# EAGLE schematic cube (EAGLE 9.0.0), part 1 of 2
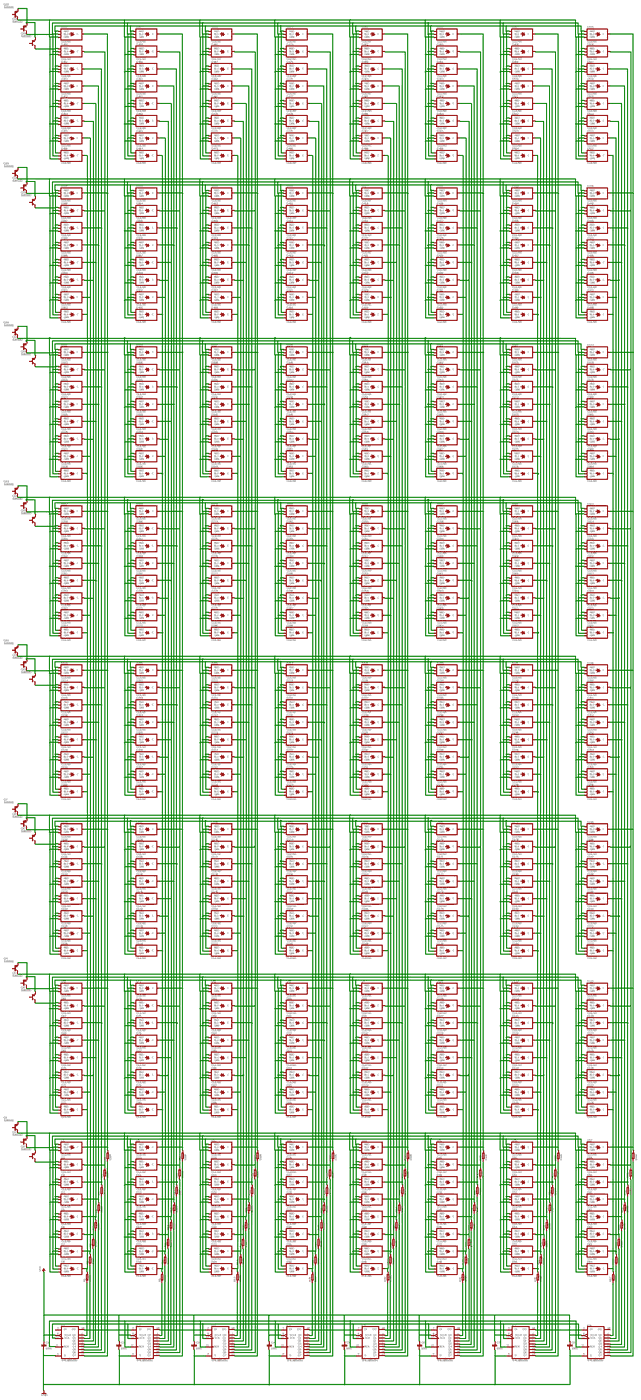
[diagram p0: schematic, sheet 1, overview]
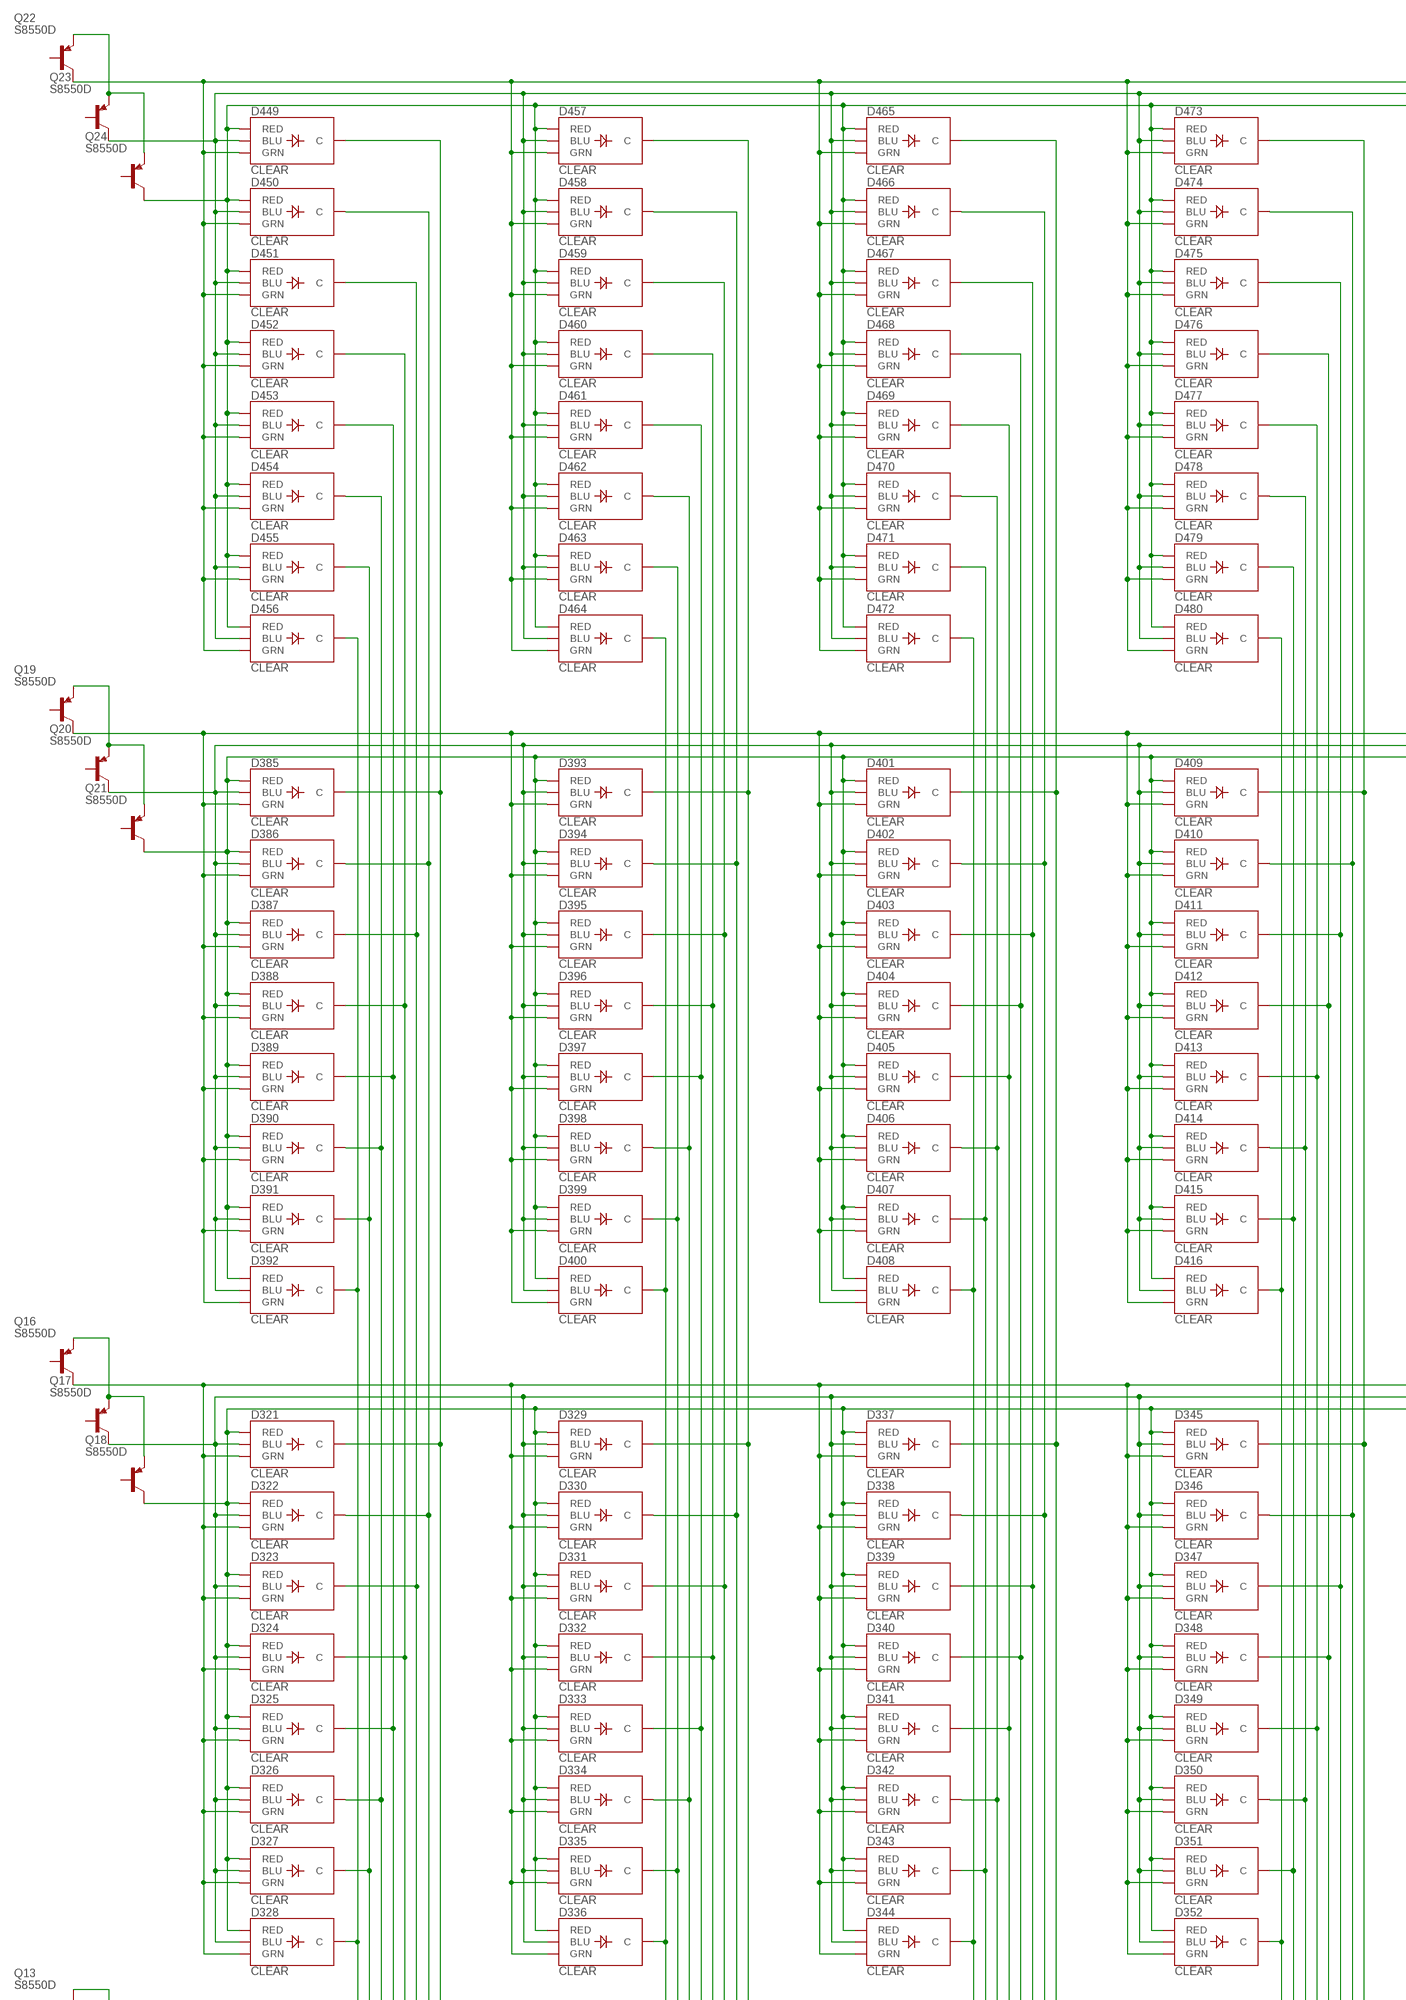
[diagram p1: schematic, sheet 1, part 1 of 8]
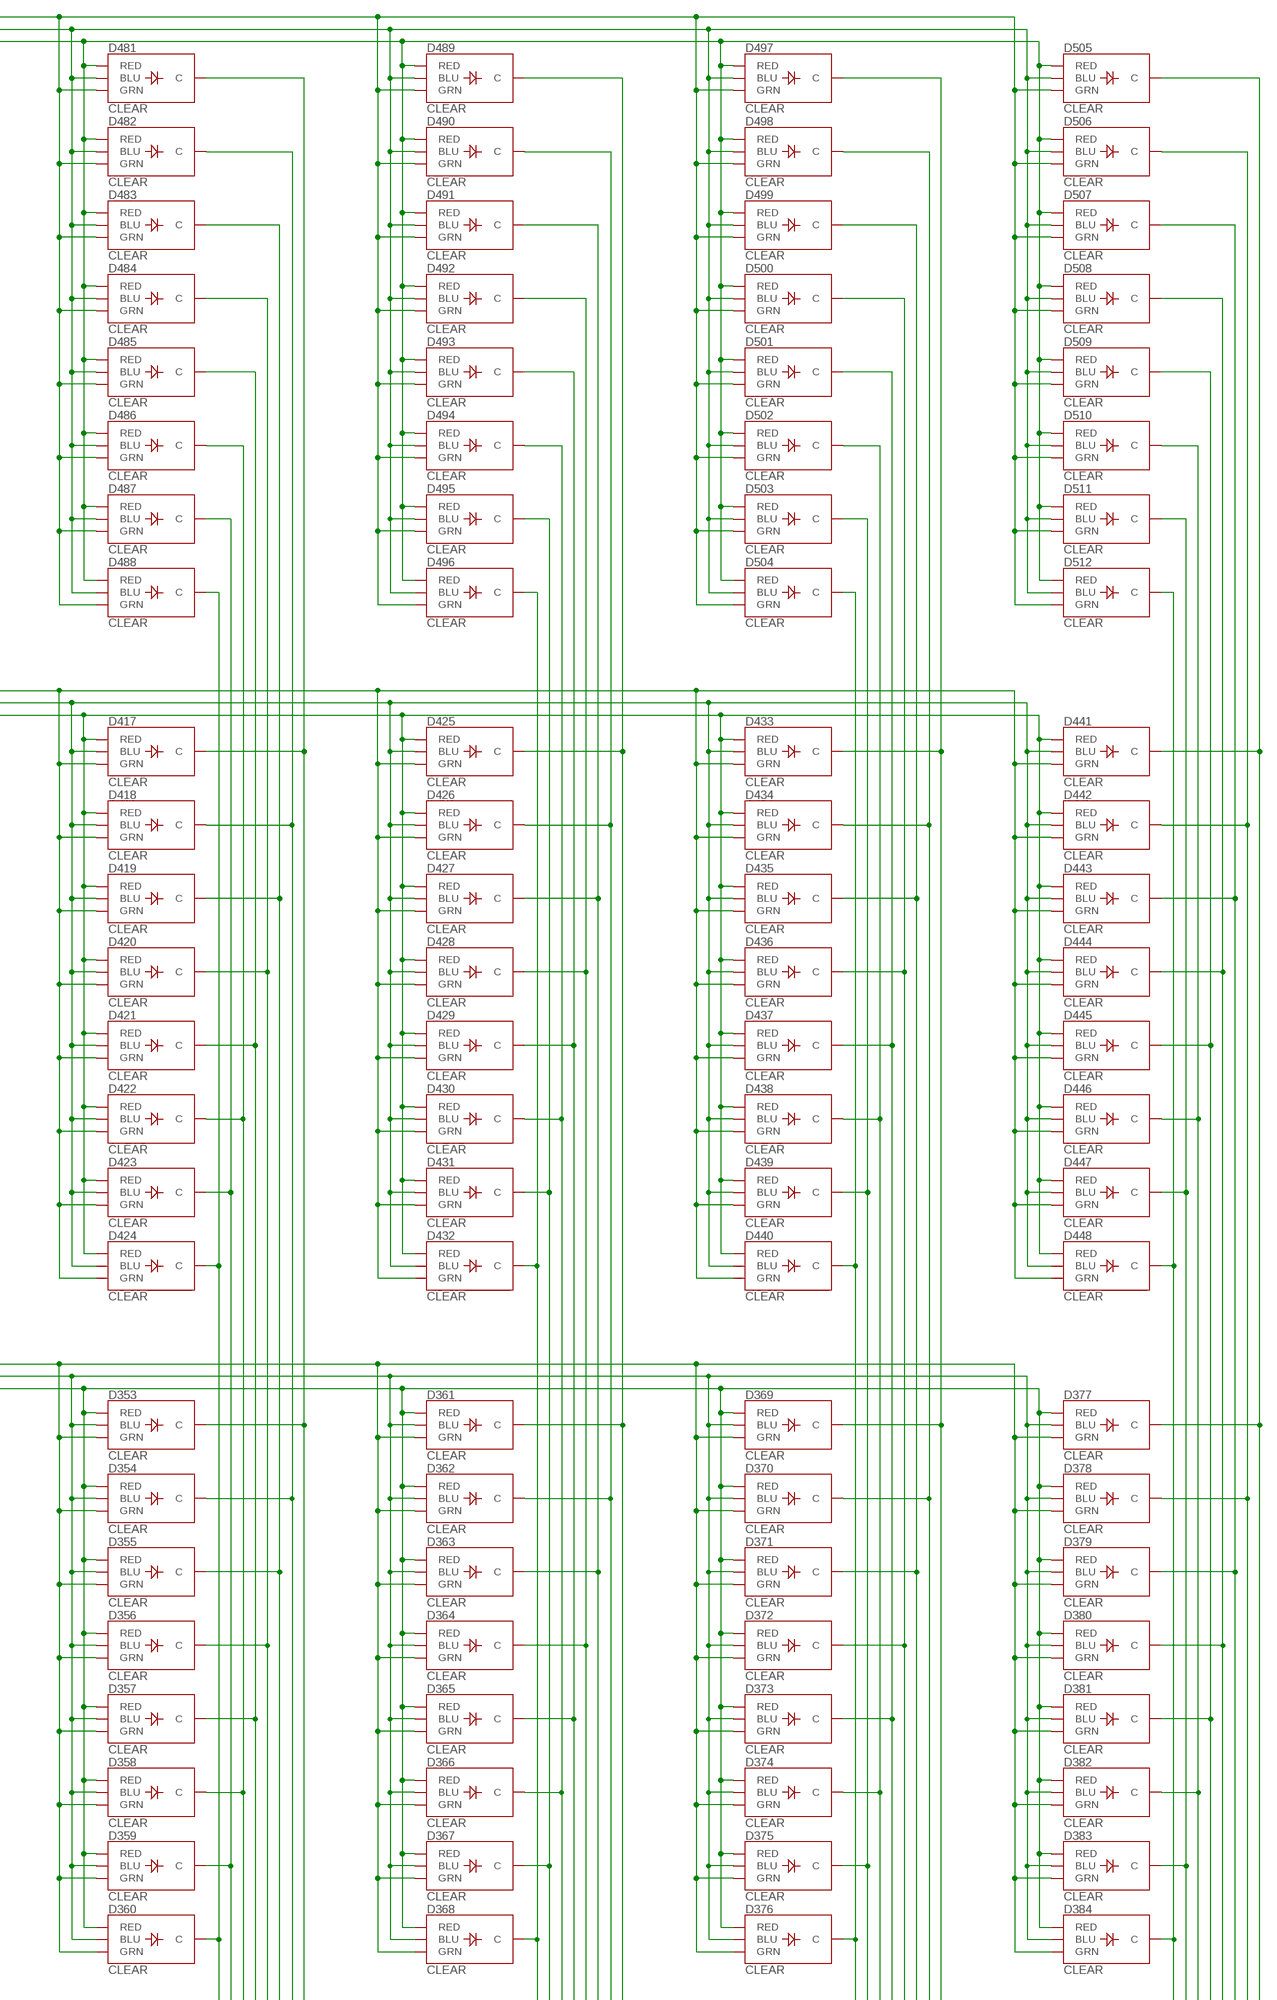
[diagram p2: schematic, sheet 1, part 2 of 8]
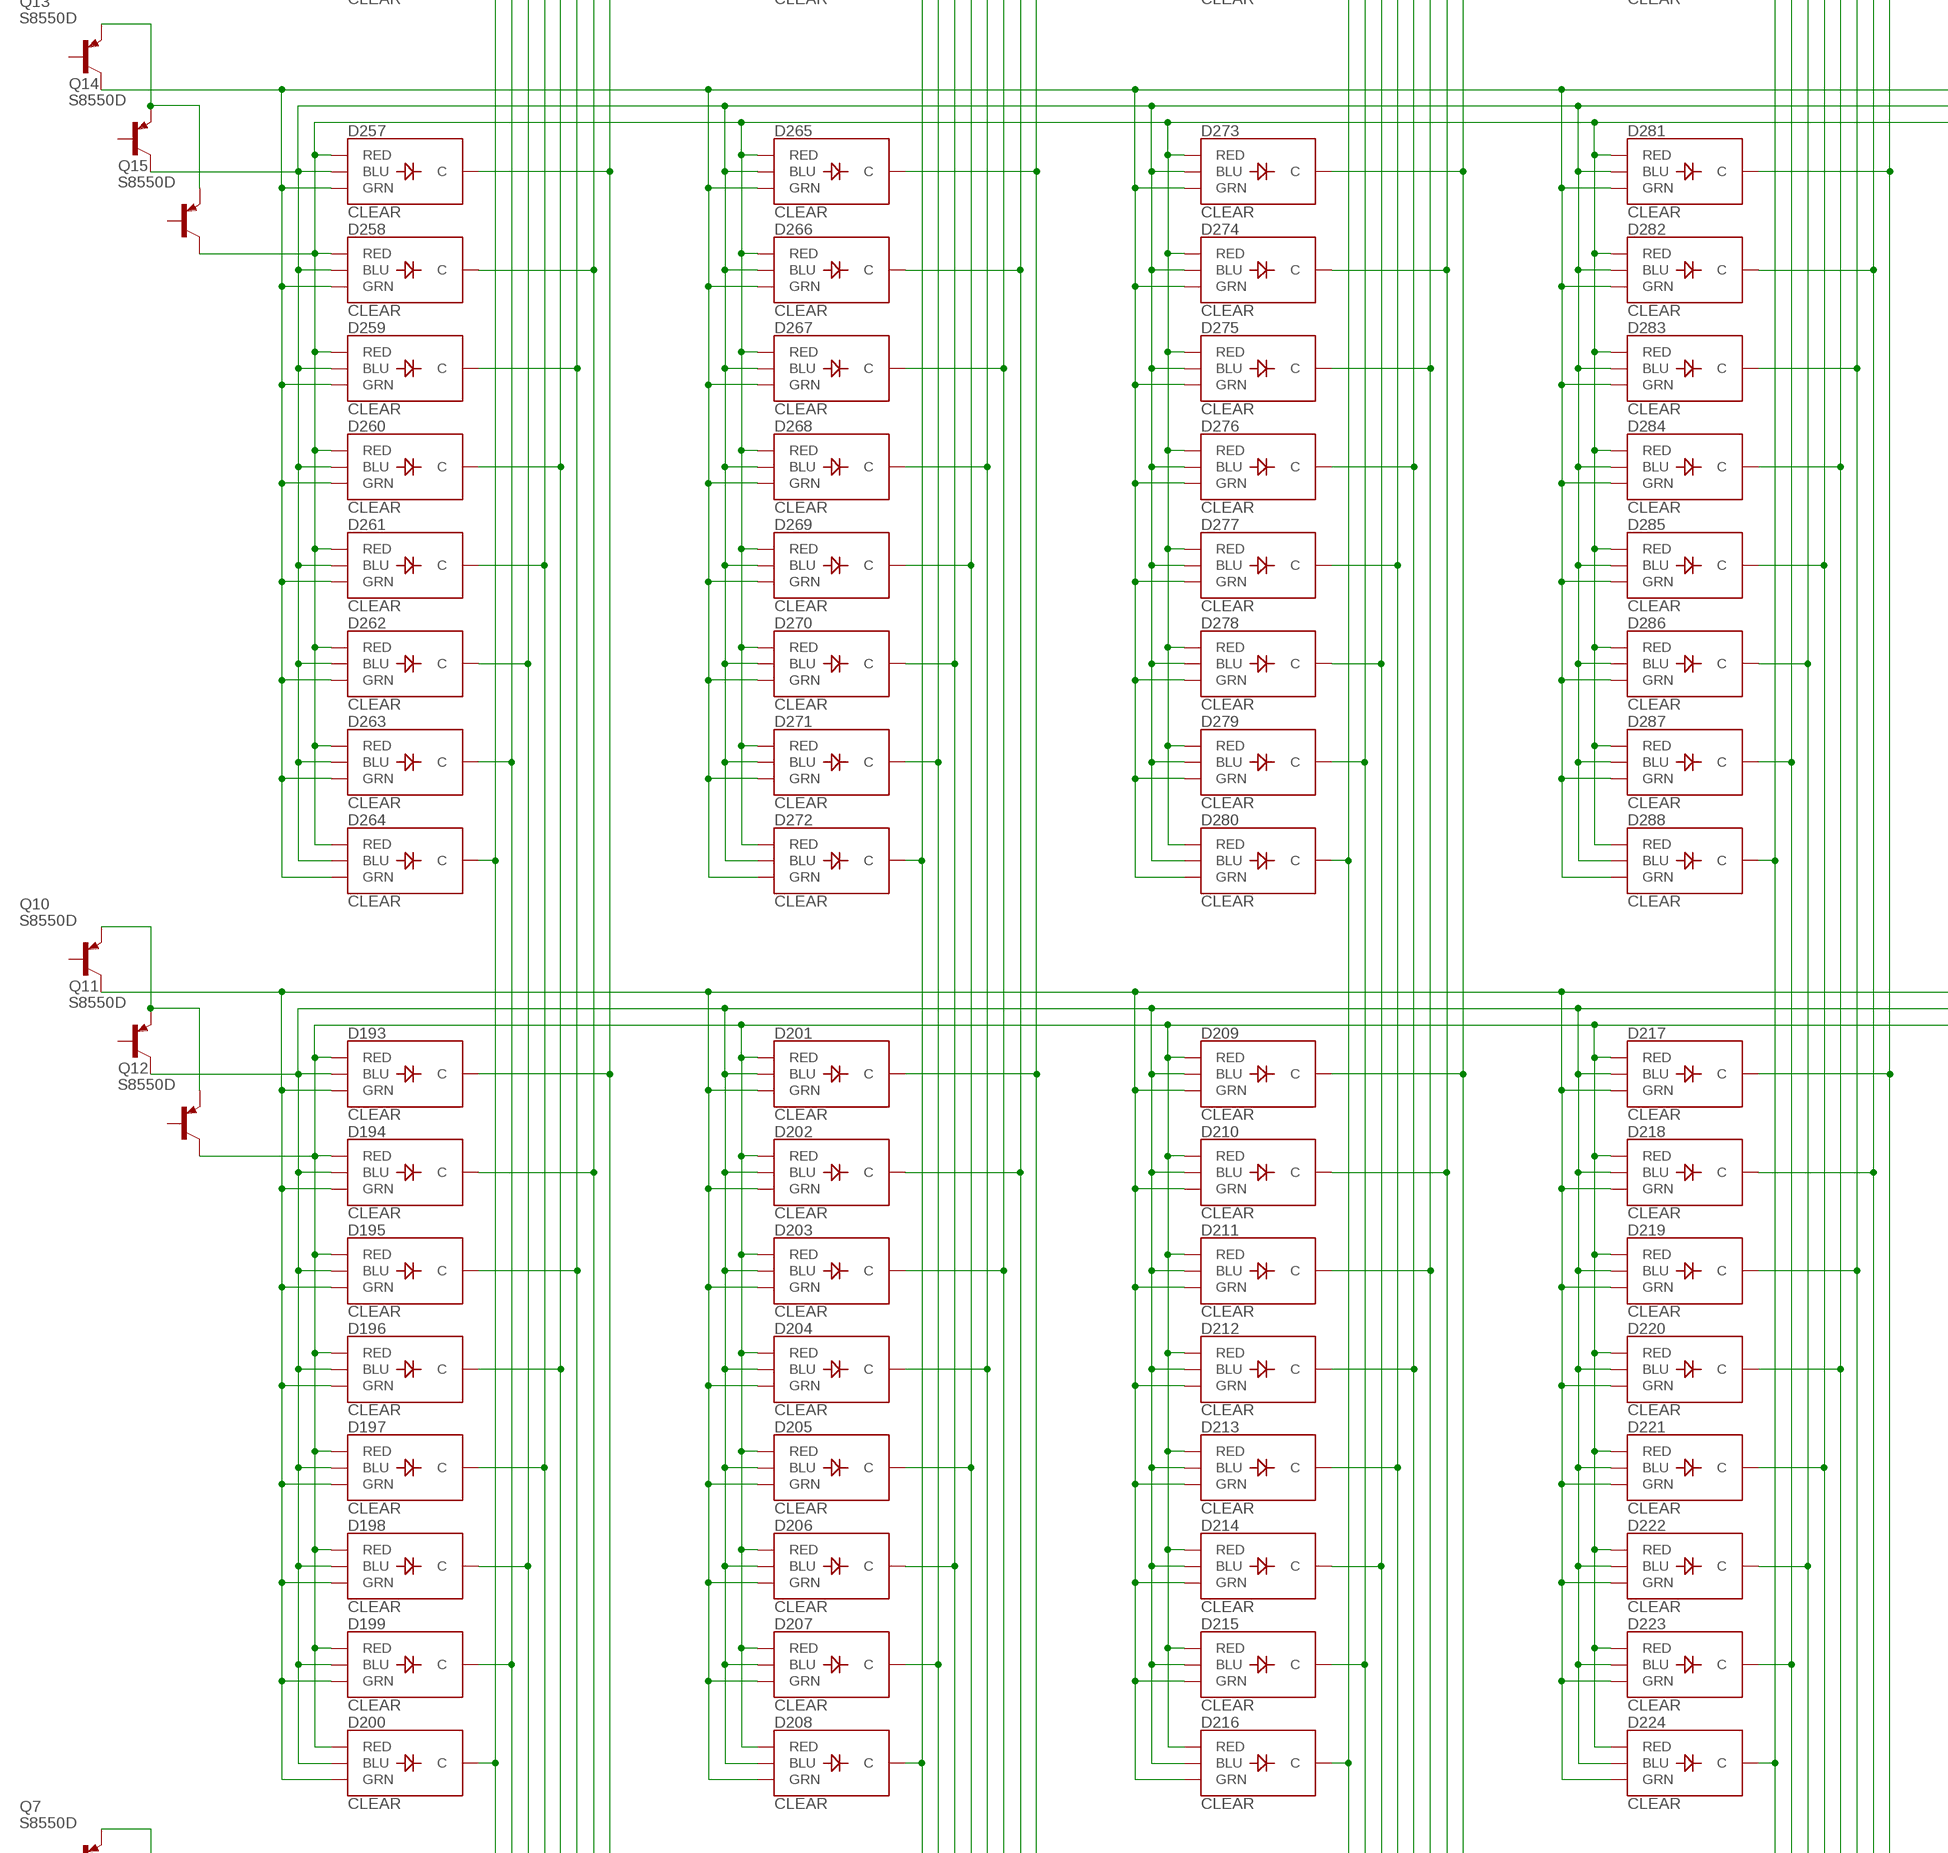
[diagram p3: schematic, sheet 1, part 3 of 8]
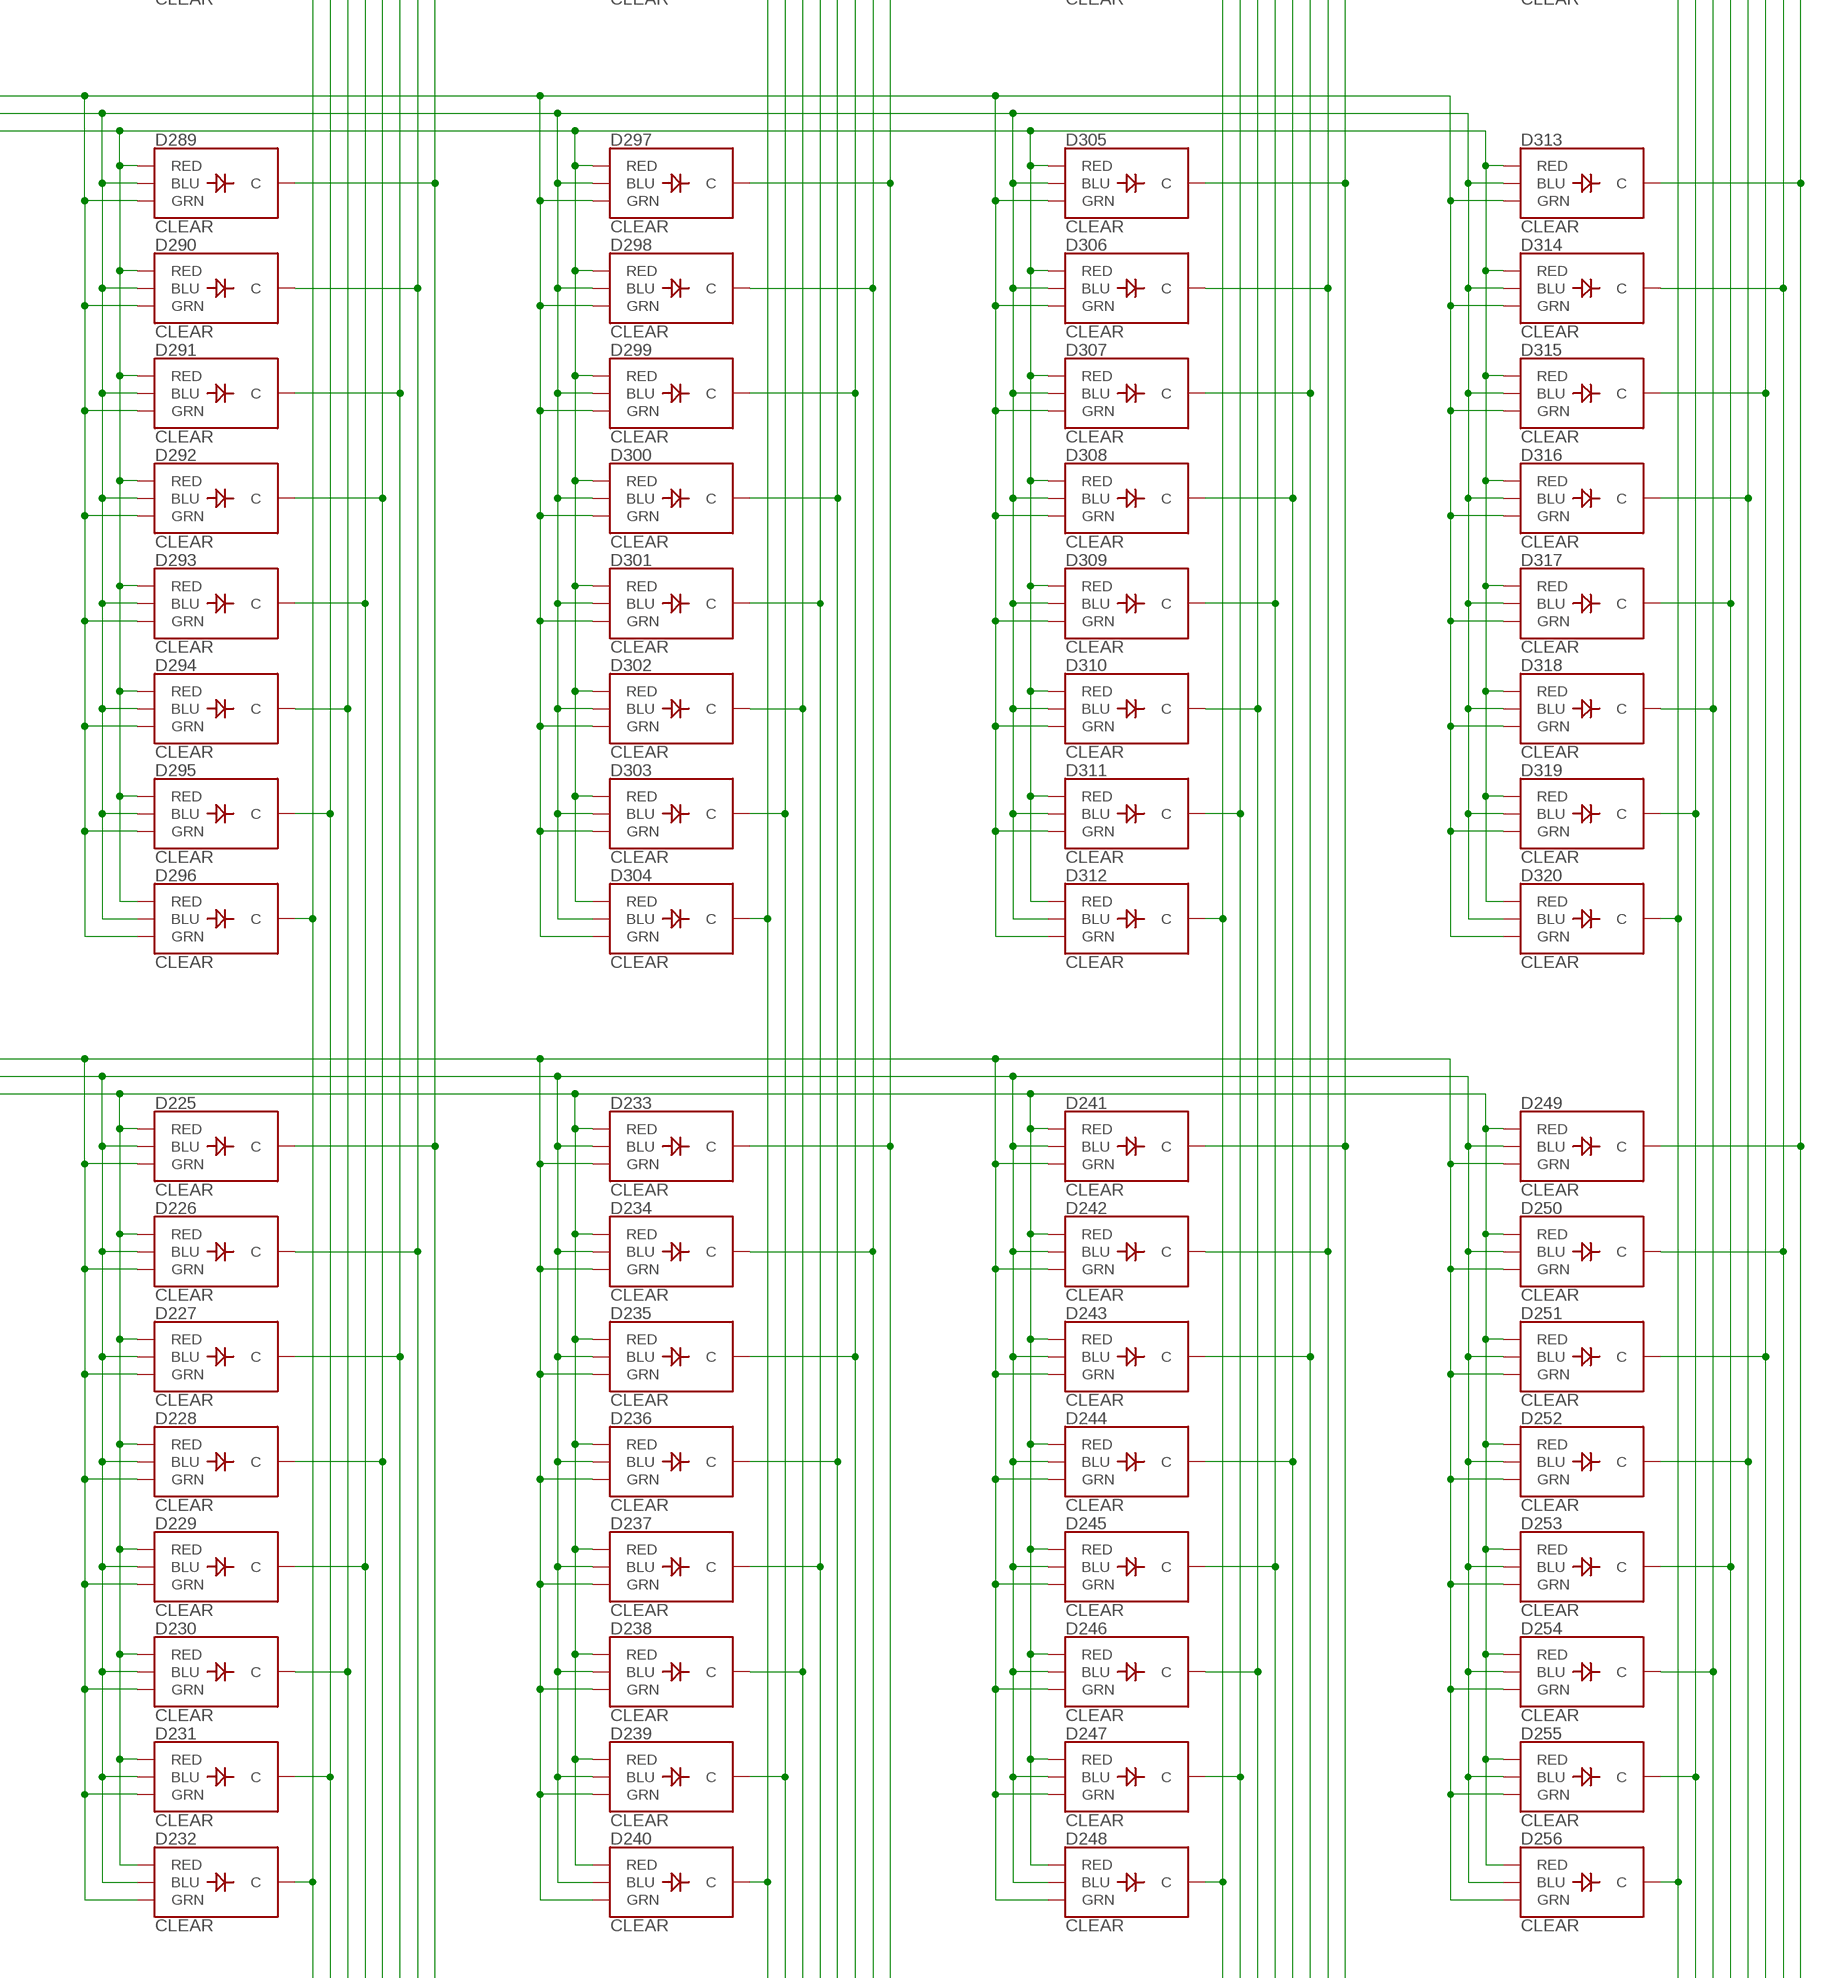
[diagram p4: schematic, sheet 1, part 4 of 8]
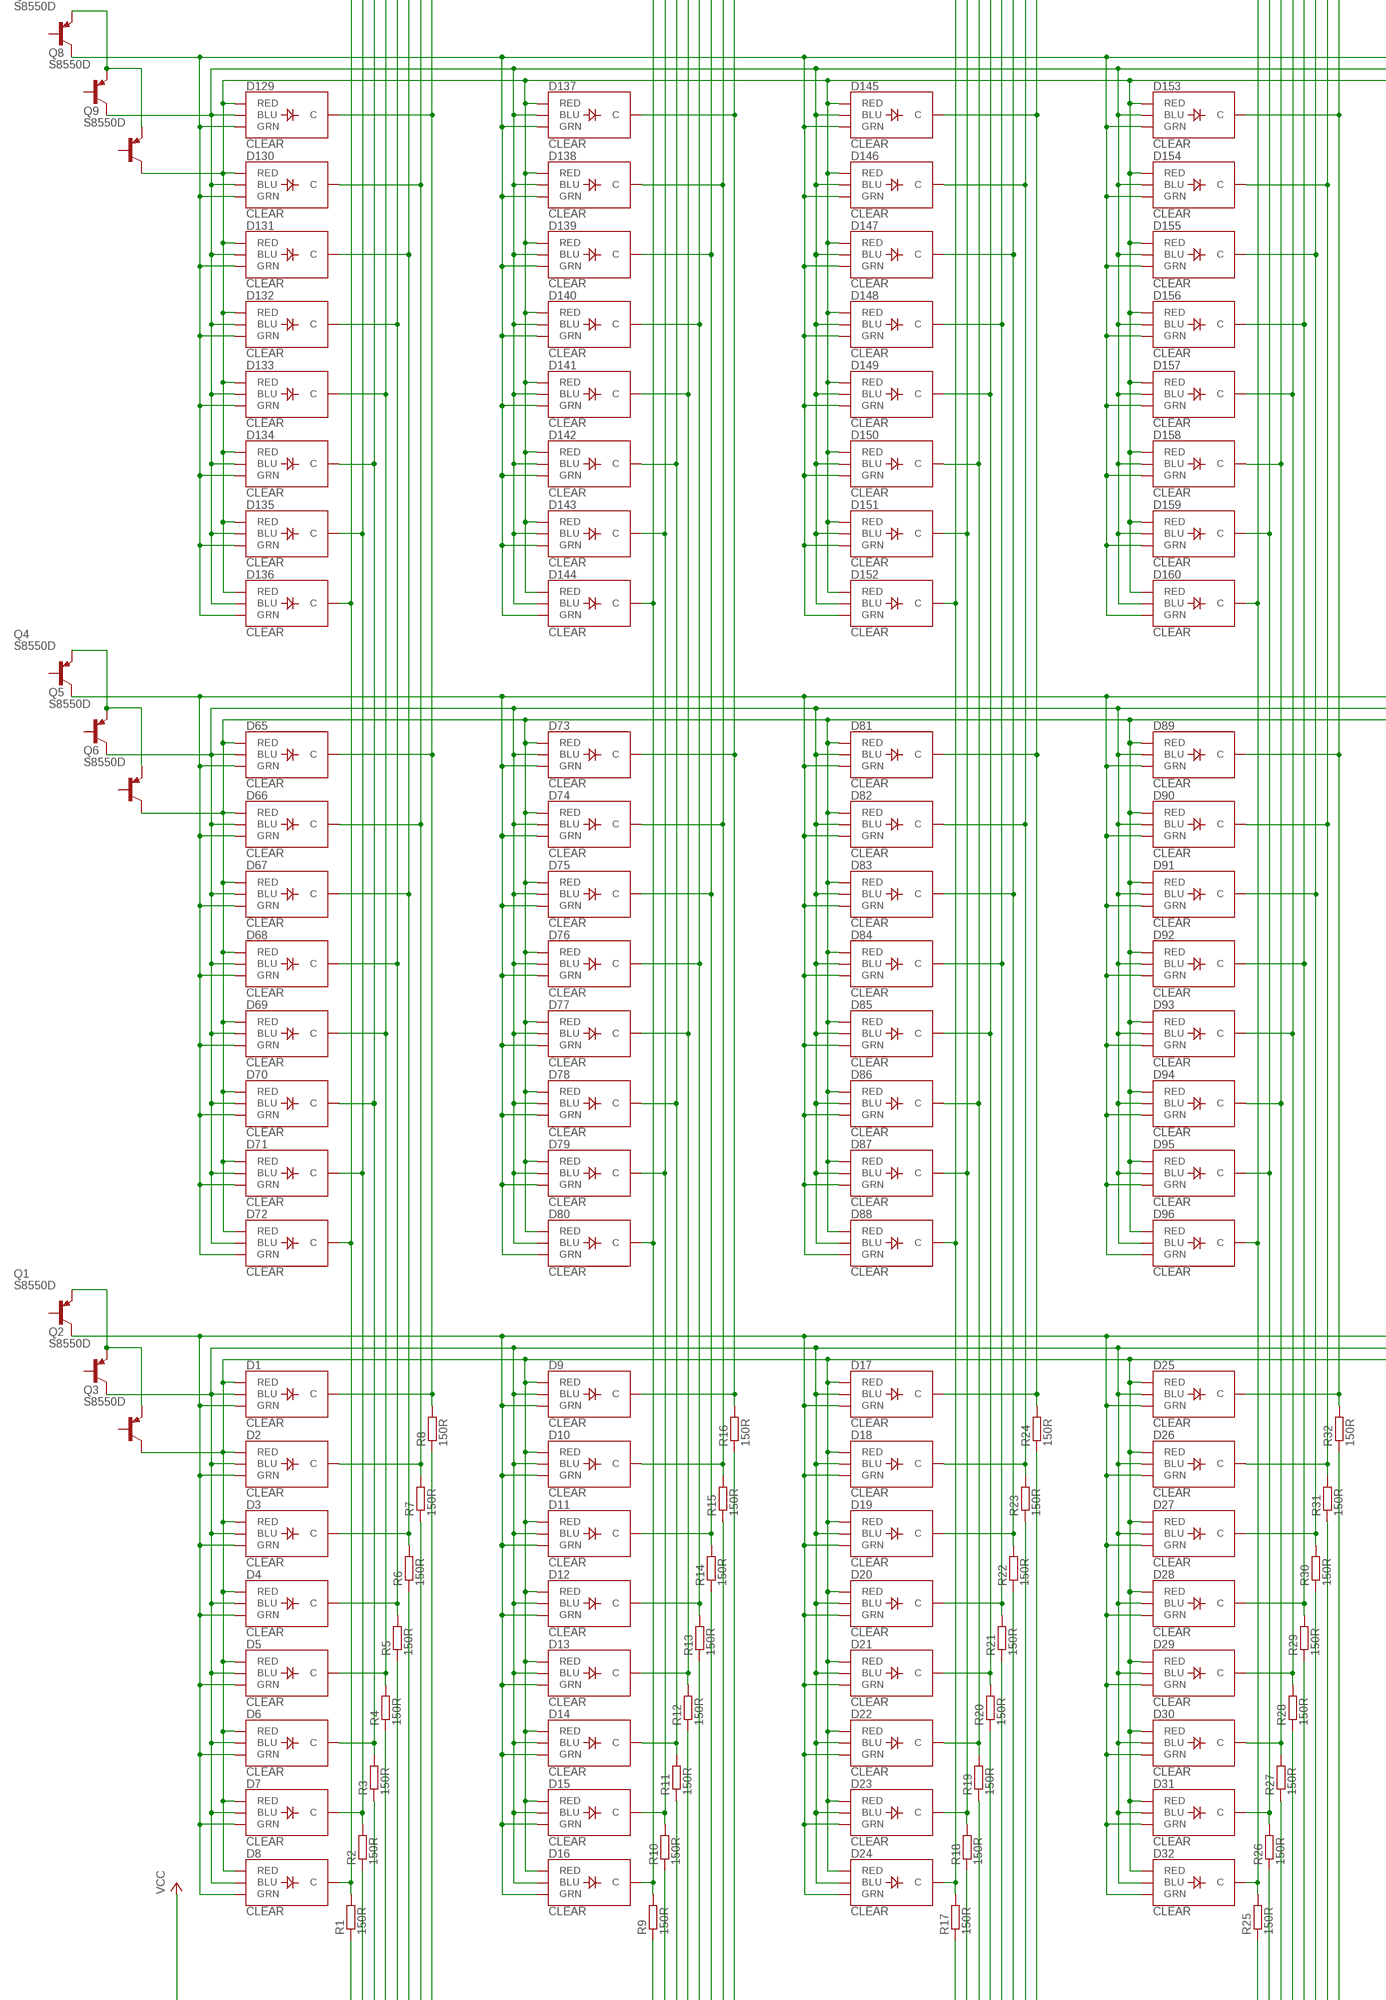
[diagram p5: schematic, sheet 1, part 5 of 8]
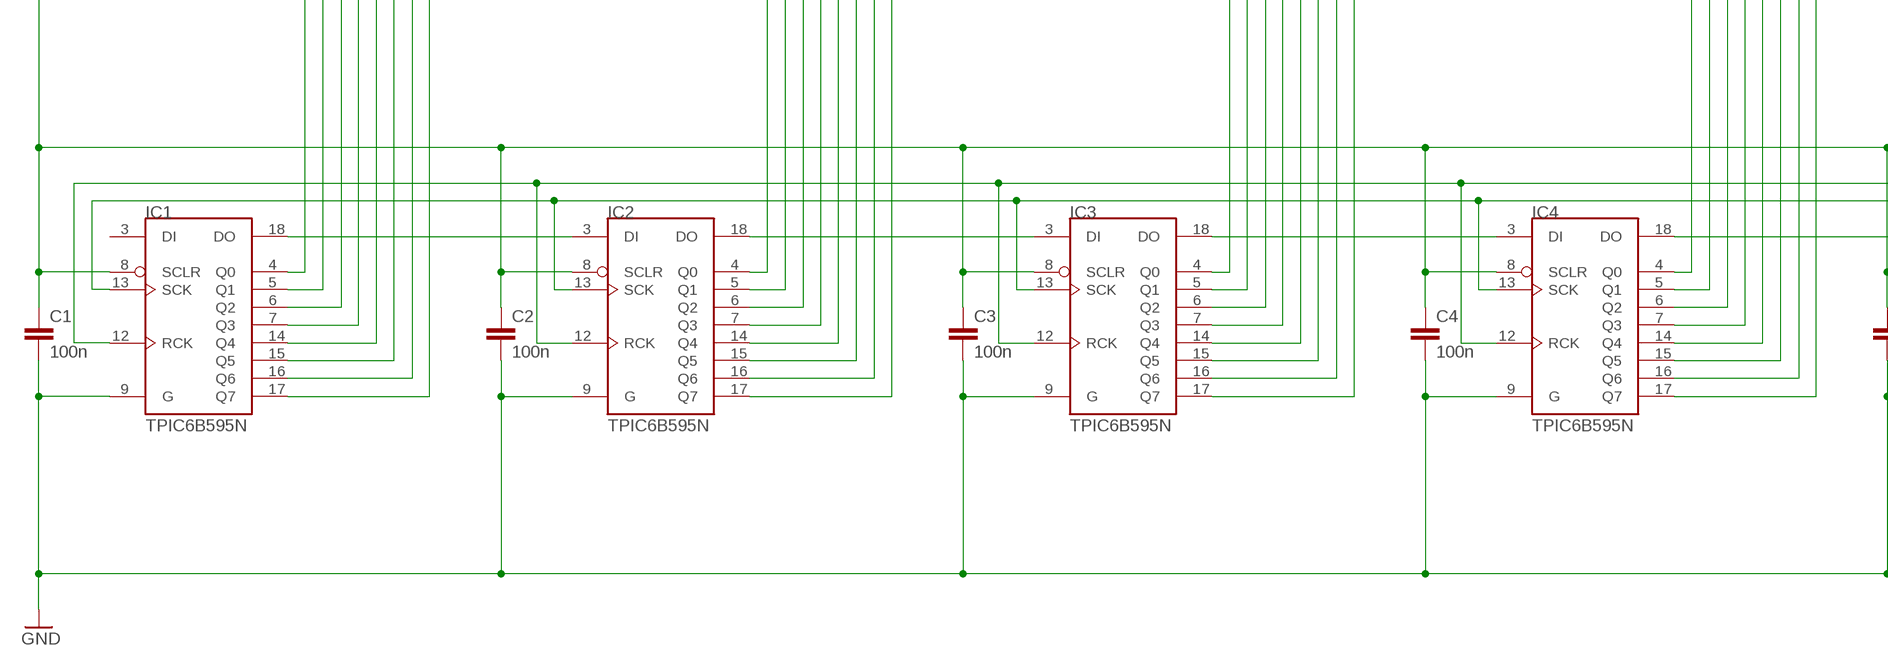
[diagram p6: schematic, sheet 1, part 6 of 8]
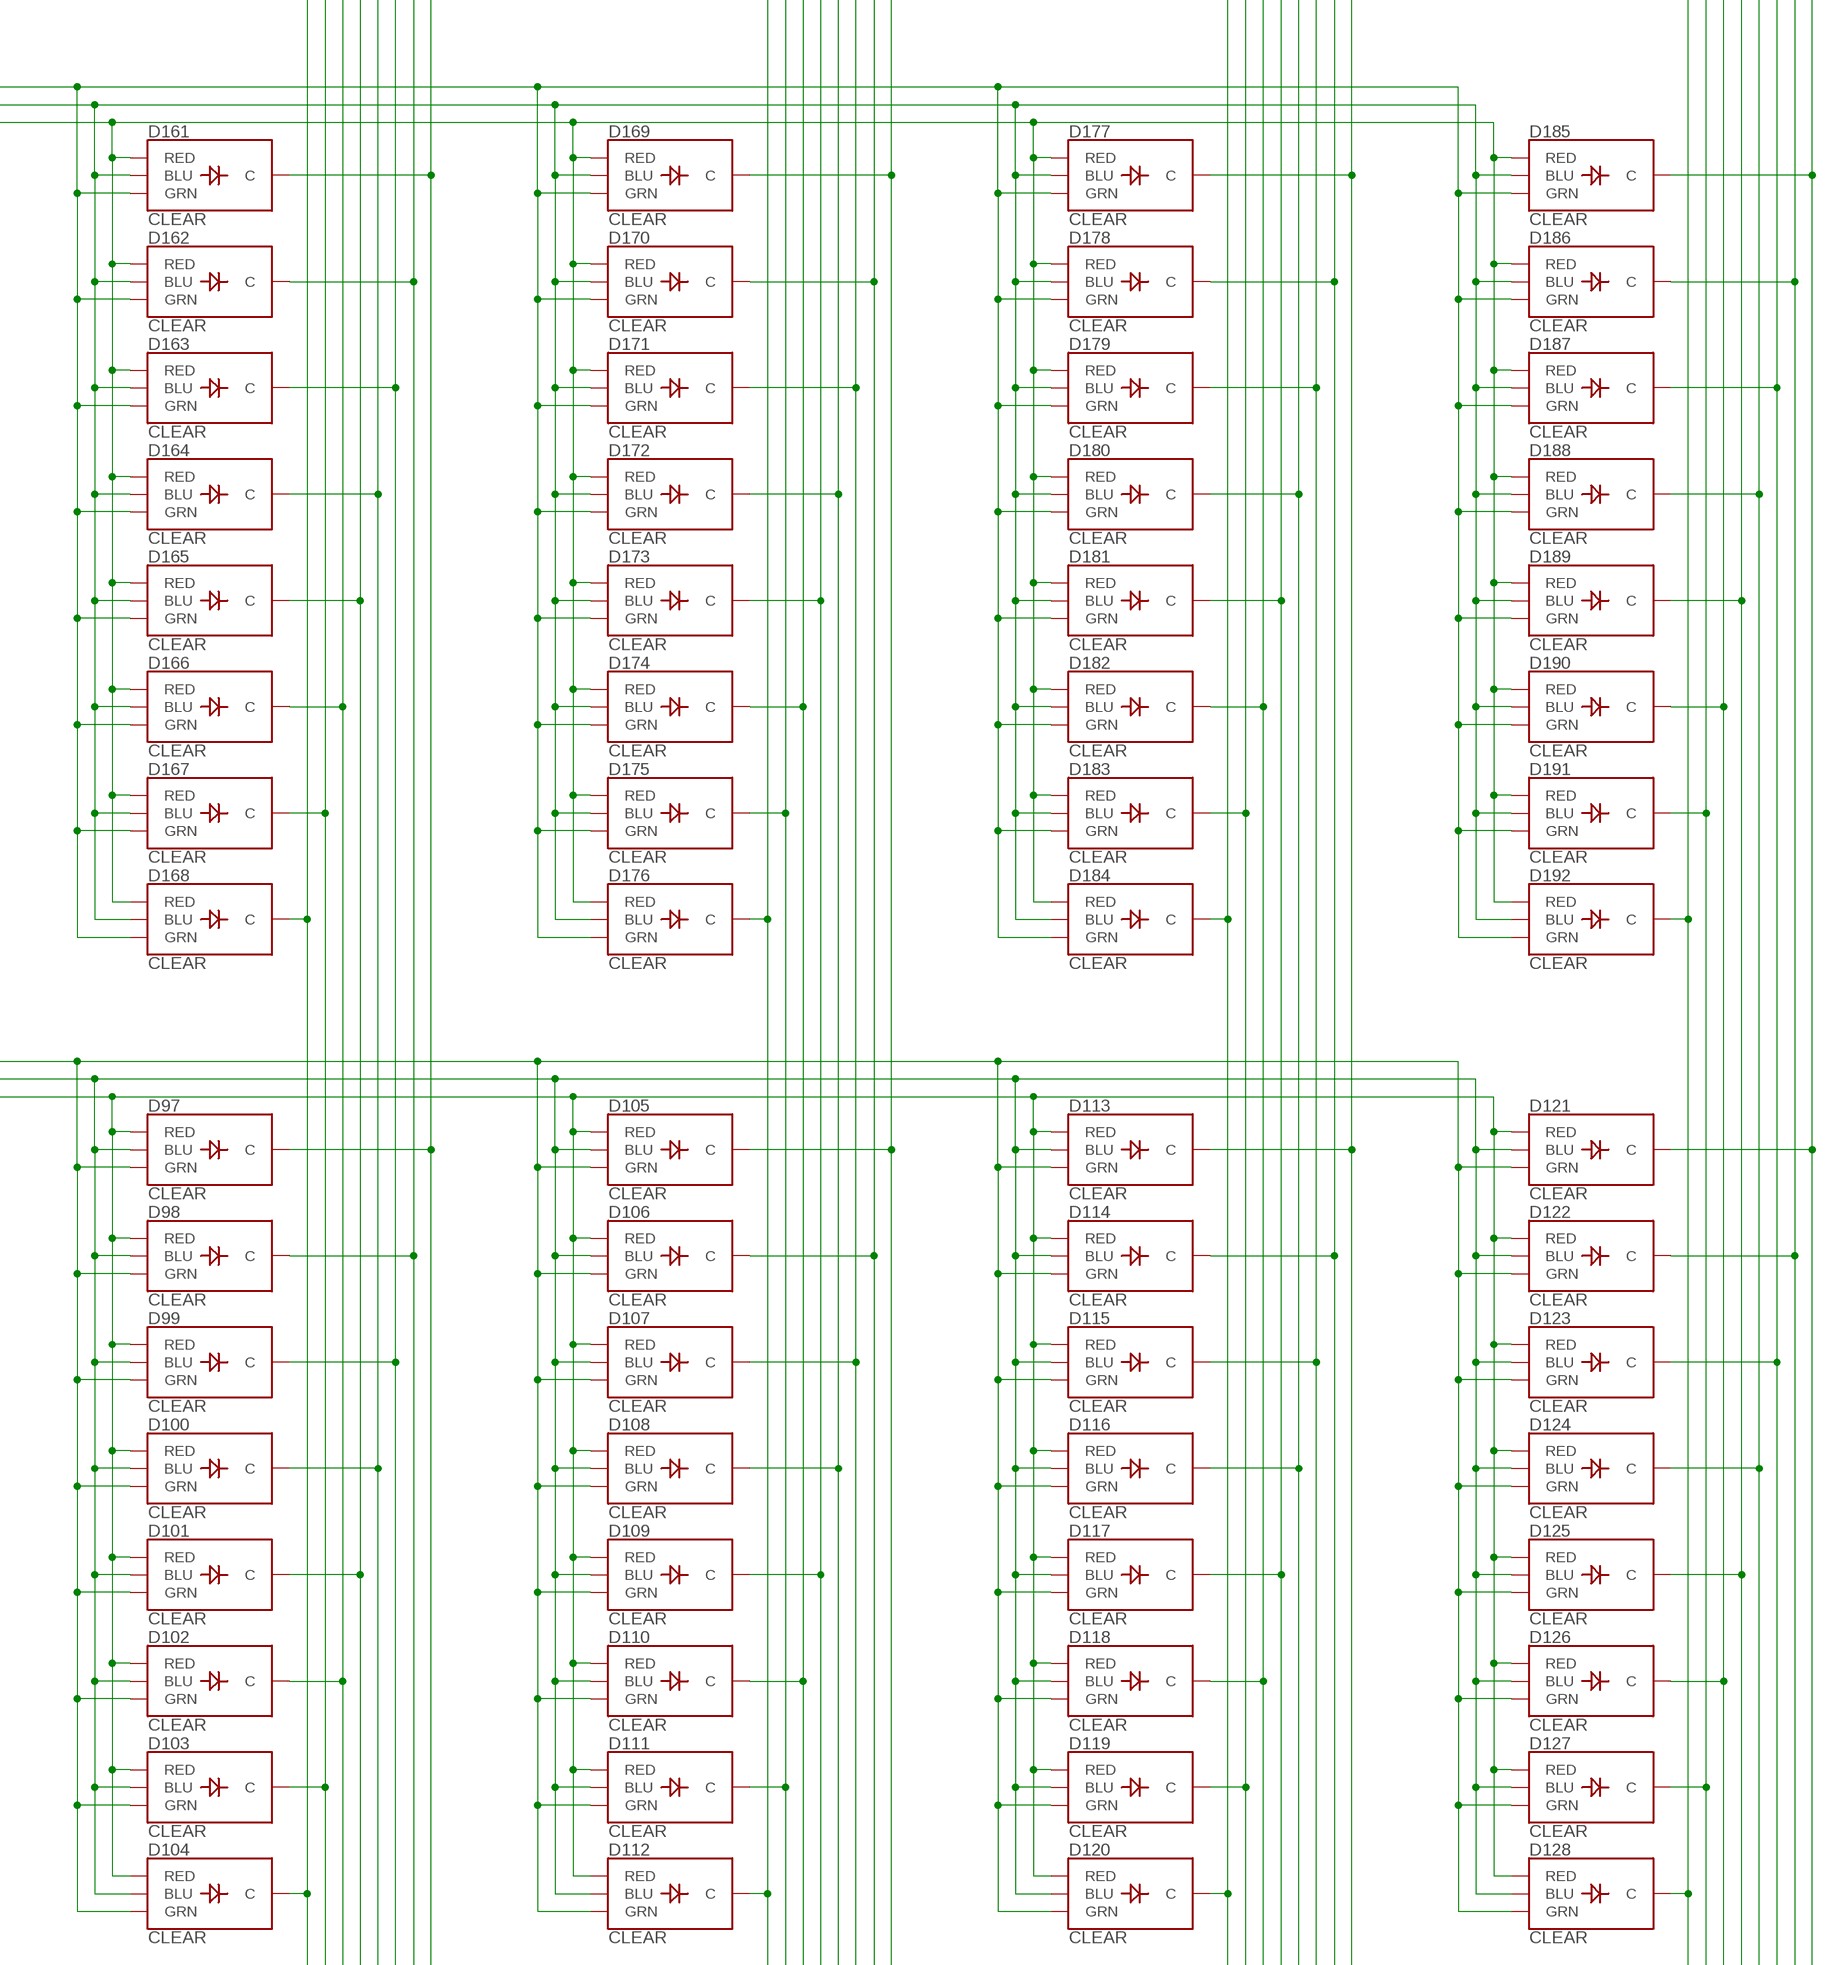
[diagram p7: schematic, sheet 1, part 7 of 8]
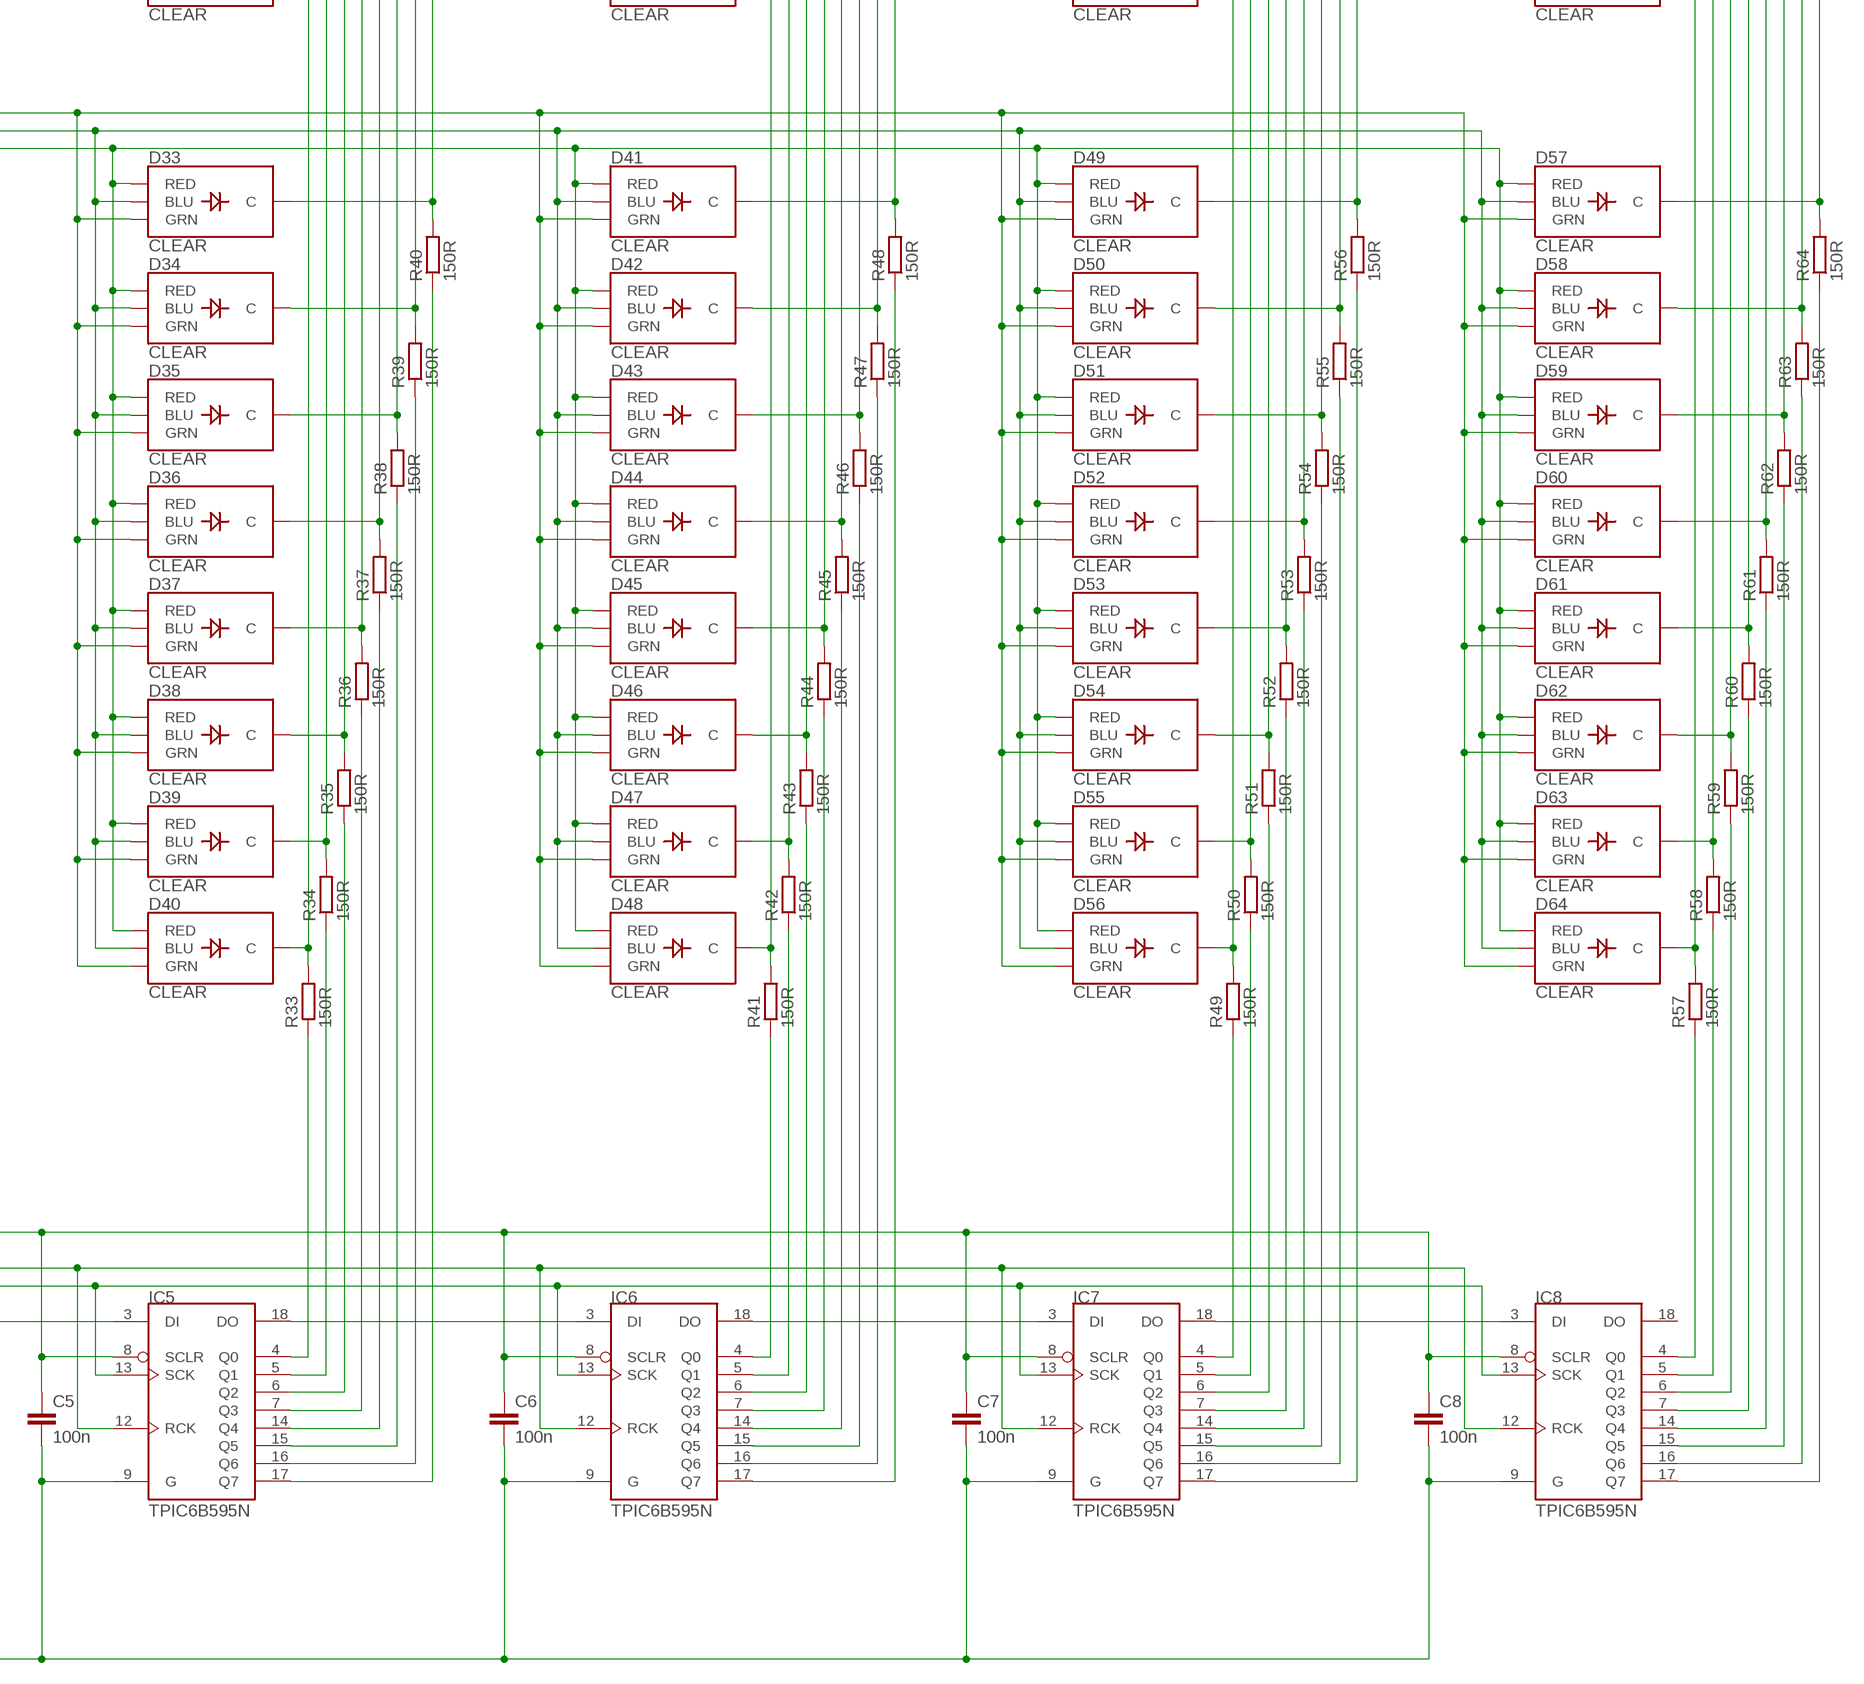
[diagram p8: schematic, sheet 1, part 8 of 8]

## Parts
C1  100n  C-EU050-024X044  [C050-024X044]
C2  100n  C-EU050-024X044  [C050-024X044]
C3  100n  C-EU050-024X044  [C050-024X044]
C4  100n  C-EU050-024X044  [C050-024X044]
C5  100n  C-EU050-024X044  [C050-024X044]
C6  100n  C-EU050-024X044  [C050-024X044]
C7  100n  C-EU050-024X044  [C050-024X044]
C8  100n  C-EU050-024X044  [C050-024X044]
D1  CLEAR  LED-RGB-CCCLEAR  [LED-RGB-THRU]
D2  CLEAR  LED-RGB-CCCLEAR  [LED-RGB-THRU]
D3  CLEAR  LED-RGB-CCCLEAR  [LED-RGB-THRU]
D4  CLEAR  LED-RGB-CCCLEAR  [LED-RGB-THRU]
D5  CLEAR  LED-RGB-CCCLEAR  [LED-RGB-THRU]
D6  CLEAR  LED-RGB-CCCLEAR  [LED-RGB-THRU]
D7  CLEAR  LED-RGB-CCCLEAR  [LED-RGB-THRU]
D8  CLEAR  LED-RGB-CCCLEAR  [LED-RGB-THRU]
D9  CLEAR  LED-RGB-CCCLEAR  [LED-RGB-THRU]
D10  CLEAR  LED-RGB-CCCLEAR  [LED-RGB-THRU]
D11  CLEAR  LED-RGB-CCCLEAR  [LED-RGB-THRU]
D12  CLEAR  LED-RGB-CCCLEAR  [LED-RGB-THRU]
D13  CLEAR  LED-RGB-CCCLEAR  [LED-RGB-THRU]
D14  CLEAR  LED-RGB-CCCLEAR  [LED-RGB-THRU]
D15  CLEAR  LED-RGB-CCCLEAR  [LED-RGB-THRU]
D16  CLEAR  LED-RGB-CCCLEAR  [LED-RGB-THRU]
D17  CLEAR  LED-RGB-CCCLEAR  [LED-RGB-THRU]
D18  CLEAR  LED-RGB-CCCLEAR  [LED-RGB-THRU]
D19  CLEAR  LED-RGB-CCCLEAR  [LED-RGB-THRU]
D20  CLEAR  LED-RGB-CCCLEAR  [LED-RGB-THRU]
D21  CLEAR  LED-RGB-CCCLEAR  [LED-RGB-THRU]
D22  CLEAR  LED-RGB-CCCLEAR  [LED-RGB-THRU]
D23  CLEAR  LED-RGB-CCCLEAR  [LED-RGB-THRU]
D24  CLEAR  LED-RGB-CCCLEAR  [LED-RGB-THRU]
D25  CLEAR  LED-RGB-CCCLEAR  [LED-RGB-THRU]
D26  CLEAR  LED-RGB-CCCLEAR  [LED-RGB-THRU]
D27  CLEAR  LED-RGB-CCCLEAR  [LED-RGB-THRU]
D28  CLEAR  LED-RGB-CCCLEAR  [LED-RGB-THRU]
D29  CLEAR  LED-RGB-CCCLEAR  [LED-RGB-THRU]
D30  CLEAR  LED-RGB-CCCLEAR  [LED-RGB-THRU]
D31  CLEAR  LED-RGB-CCCLEAR  [LED-RGB-THRU]
D32  CLEAR  LED-RGB-CCCLEAR  [LED-RGB-THRU]
D33  CLEAR  LED-RGB-CCCLEAR  [LED-RGB-THRU]
D34  CLEAR  LED-RGB-CCCLEAR  [LED-RGB-THRU]
D35  CLEAR  LED-RGB-CCCLEAR  [LED-RGB-THRU]
D36  CLEAR  LED-RGB-CCCLEAR  [LED-RGB-THRU]
D37  CLEAR  LED-RGB-CCCLEAR  [LED-RGB-THRU]
D38  CLEAR  LED-RGB-CCCLEAR  [LED-RGB-THRU]
D39  CLEAR  LED-RGB-CCCLEAR  [LED-RGB-THRU]
D40  CLEAR  LED-RGB-CCCLEAR  [LED-RGB-THRU]
D41  CLEAR  LED-RGB-CCCLEAR  [LED-RGB-THRU]
D42  CLEAR  LED-RGB-CCCLEAR  [LED-RGB-THRU]
D43  CLEAR  LED-RGB-CCCLEAR  [LED-RGB-THRU]
D44  CLEAR  LED-RGB-CCCLEAR  [LED-RGB-THRU]
D45  CLEAR  LED-RGB-CCCLEAR  [LED-RGB-THRU]
D46  CLEAR  LED-RGB-CCCLEAR  [LED-RGB-THRU]
D47  CLEAR  LED-RGB-CCCLEAR  [LED-RGB-THRU]
D48  CLEAR  LED-RGB-CCCLEAR  [LED-RGB-THRU]
D49  CLEAR  LED-RGB-CCCLEAR  [LED-RGB-THRU]
D50  CLEAR  LED-RGB-CCCLEAR  [LED-RGB-THRU]
D51  CLEAR  LED-RGB-CCCLEAR  [LED-RGB-THRU]
D52  CLEAR  LED-RGB-CCCLEAR  [LED-RGB-THRU]
D53  CLEAR  LED-RGB-CCCLEAR  [LED-RGB-THRU]
D54  CLEAR  LED-RGB-CCCLEAR  [LED-RGB-THRU]
D55  CLEAR  LED-RGB-CCCLEAR  [LED-RGB-THRU]
D56  CLEAR  LED-RGB-CCCLEAR  [LED-RGB-THRU]
D57  CLEAR  LED-RGB-CCCLEAR  [LED-RGB-THRU]
D58  CLEAR  LED-RGB-CCCLEAR  [LED-RGB-THRU]
D59  CLEAR  LED-RGB-CCCLEAR  [LED-RGB-THRU]
D60  CLEAR  LED-RGB-CCCLEAR  [LED-RGB-THRU]
D61  CLEAR  LED-RGB-CCCLEAR  [LED-RGB-THRU]
D62  CLEAR  LED-RGB-CCCLEAR  [LED-RGB-THRU]
D63  CLEAR  LED-RGB-CCCLEAR  [LED-RGB-THRU]
D64  CLEAR  LED-RGB-CCCLEAR  [LED-RGB-THRU]
D65  CLEAR  LED-RGB-CCCLEAR  [LED-RGB-THRU]
D66  CLEAR  LED-RGB-CCCLEAR  [LED-RGB-THRU]
D67  CLEAR  LED-RGB-CCCLEAR  [LED-RGB-THRU]
D68  CLEAR  LED-RGB-CCCLEAR  [LED-RGB-THRU]
D69  CLEAR  LED-RGB-CCCLEAR  [LED-RGB-THRU]
D70  CLEAR  LED-RGB-CCCLEAR  [LED-RGB-THRU]
D71  CLEAR  LED-RGB-CCCLEAR  [LED-RGB-THRU]
D72  CLEAR  LED-RGB-CCCLEAR  [LED-RGB-THRU]
D73  CLEAR  LED-RGB-CCCLEAR  [LED-RGB-THRU]
D74  CLEAR  LED-RGB-CCCLEAR  [LED-RGB-THRU]
D75  CLEAR  LED-RGB-CCCLEAR  [LED-RGB-THRU]
D76  CLEAR  LED-RGB-CCCLEAR  [LED-RGB-THRU]
D77  CLEAR  LED-RGB-CCCLEAR  [LED-RGB-THRU]
D78  CLEAR  LED-RGB-CCCLEAR  [LED-RGB-THRU]
D79  CLEAR  LED-RGB-CCCLEAR  [LED-RGB-THRU]
D80  CLEAR  LED-RGB-CCCLEAR  [LED-RGB-THRU]
D81  CLEAR  LED-RGB-CCCLEAR  [LED-RGB-THRU]
D82  CLEAR  LED-RGB-CCCLEAR  [LED-RGB-THRU]
D83  CLEAR  LED-RGB-CCCLEAR  [LED-RGB-THRU]
D84  CLEAR  LED-RGB-CCCLEAR  [LED-RGB-THRU]
D85  CLEAR  LED-RGB-CCCLEAR  [LED-RGB-THRU]
D86  CLEAR  LED-RGB-CCCLEAR  [LED-RGB-THRU]
D87  CLEAR  LED-RGB-CCCLEAR  [LED-RGB-THRU]
D88  CLEAR  LED-RGB-CCCLEAR  [LED-RGB-THRU]
D89  CLEAR  LED-RGB-CCCLEAR  [LED-RGB-THRU]
D90  CLEAR  LED-RGB-CCCLEAR  [LED-RGB-THRU]
D91  CLEAR  LED-RGB-CCCLEAR  [LED-RGB-THRU]
D92  CLEAR  LED-RGB-CCCLEAR  [LED-RGB-THRU]
D93  CLEAR  LED-RGB-CCCLEAR  [LED-RGB-THRU]
D94  CLEAR  LED-RGB-CCCLEAR  [LED-RGB-THRU]
D95  CLEAR  LED-RGB-CCCLEAR  [LED-RGB-THRU]
D96  CLEAR  LED-RGB-CCCLEAR  [LED-RGB-THRU]
D97  CLEAR  LED-RGB-CCCLEAR  [LED-RGB-THRU]
D98  CLEAR  LED-RGB-CCCLEAR  [LED-RGB-THRU]
D99  CLEAR  LED-RGB-CCCLEAR  [LED-RGB-THRU]
D100  CLEAR  LED-RGB-CCCLEAR  [LED-RGB-THRU]
D101  CLEAR  LED-RGB-CCCLEAR  [LED-RGB-THRU]
D102  CLEAR  LED-RGB-CCCLEAR  [LED-RGB-THRU]
D103  CLEAR  LED-RGB-CCCLEAR  [LED-RGB-THRU]
D104  CLEAR  LED-RGB-CCCLEAR  [LED-RGB-THRU]
D105  CLEAR  LED-RGB-CCCLEAR  [LED-RGB-THRU]
D106  CLEAR  LED-RGB-CCCLEAR  [LED-RGB-THRU]
D107  CLEAR  LED-RGB-CCCLEAR  [LED-RGB-THRU]
D108  CLEAR  LED-RGB-CCCLEAR  [LED-RGB-THRU]
D109  CLEAR  LED-RGB-CCCLEAR  [LED-RGB-THRU]
D110  CLEAR  LED-RGB-CCCLEAR  [LED-RGB-THRU]
D111  CLEAR  LED-RGB-CCCLEAR  [LED-RGB-THRU]
D112  CLEAR  LED-RGB-CCCLEAR  [LED-RGB-THRU]
D113  CLEAR  LED-RGB-CCCLEAR  [LED-RGB-THRU]
D114  CLEAR  LED-RGB-CCCLEAR  [LED-RGB-THRU]
D115  CLEAR  LED-RGB-CCCLEAR  [LED-RGB-THRU]
D116  CLEAR  LED-RGB-CCCLEAR  [LED-RGB-THRU]
D117  CLEAR  LED-RGB-CCCLEAR  [LED-RGB-THRU]
D118  CLEAR  LED-RGB-CCCLEAR  [LED-RGB-THRU]
D119  CLEAR  LED-RGB-CCCLEAR  [LED-RGB-THRU]
D120  CLEAR  LED-RGB-CCCLEAR  [LED-RGB-THRU]
D121  CLEAR  LED-RGB-CCCLEAR  [LED-RGB-THRU]
D122  CLEAR  LED-RGB-CCCLEAR  [LED-RGB-THRU]
D123  CLEAR  LED-RGB-CCCLEAR  [LED-RGB-THRU]
D124  CLEAR  LED-RGB-CCCLEAR  [LED-RGB-THRU]
D125  CLEAR  LED-RGB-CCCLEAR  [LED-RGB-THRU]
D126  CLEAR  LED-RGB-CCCLEAR  [LED-RGB-THRU]
D127  CLEAR  LED-RGB-CCCLEAR  [LED-RGB-THRU]
D128  CLEAR  LED-RGB-CCCLEAR  [LED-RGB-THRU]
D129  CLEAR  LED-RGB-CCCLEAR  [LED-RGB-THRU]
D130  CLEAR  LED-RGB-CCCLEAR  [LED-RGB-THRU]
D131  CLEAR  LED-RGB-CCCLEAR  [LED-RGB-THRU]
D132  CLEAR  LED-RGB-CCCLEAR  [LED-RGB-THRU]
D133  CLEAR  LED-RGB-CCCLEAR  [LED-RGB-THRU]
D134  CLEAR  LED-RGB-CCCLEAR  [LED-RGB-THRU]
D135  CLEAR  LED-RGB-CCCLEAR  [LED-RGB-THRU]
D136  CLEAR  LED-RGB-CCCLEAR  [LED-RGB-THRU]
D137  CLEAR  LED-RGB-CCCLEAR  [LED-RGB-THRU]
D138  CLEAR  LED-RGB-CCCLEAR  [LED-RGB-THRU]
D139  CLEAR  LED-RGB-CCCLEAR  [LED-RGB-THRU]
D140  CLEAR  LED-RGB-CCCLEAR  [LED-RGB-THRU]
D141  CLEAR  LED-RGB-CCCLEAR  [LED-RGB-THRU]
D142  CLEAR  LED-RGB-CCCLEAR  [LED-RGB-THRU]
D143  CLEAR  LED-RGB-CCCLEAR  [LED-RGB-THRU]
D144  CLEAR  LED-RGB-CCCLEAR  [LED-RGB-THRU]
D145  CLEAR  LED-RGB-CCCLEAR  [LED-RGB-THRU]
D146  CLEAR  LED-RGB-CCCLEAR  [LED-RGB-THRU]
D147  CLEAR  LED-RGB-CCCLEAR  [LED-RGB-THRU]
D148  CLEAR  LED-RGB-CCCLEAR  [LED-RGB-THRU]
D149  CLEAR  LED-RGB-CCCLEAR  [LED-RGB-THRU]
D150  CLEAR  LED-RGB-CCCLEAR  [LED-RGB-THRU]
D151  CLEAR  LED-RGB-CCCLEAR  [LED-RGB-THRU]
D152  CLEAR  LED-RGB-CCCLEAR  [LED-RGB-THRU]
D153  CLEAR  LED-RGB-CCCLEAR  [LED-RGB-THRU]
D154  CLEAR  LED-RGB-CCCLEAR  [LED-RGB-THRU]
D155  CLEAR  LED-RGB-CCCLEAR  [LED-RGB-THRU]
D156  CLEAR  LED-RGB-CCCLEAR  [LED-RGB-THRU]
D157  CLEAR  LED-RGB-CCCLEAR  [LED-RGB-THRU]
D158  CLEAR  LED-RGB-CCCLEAR  [LED-RGB-THRU]
D159  CLEAR  LED-RGB-CCCLEAR  [LED-RGB-THRU]
D160  CLEAR  LED-RGB-CCCLEAR  [LED-RGB-THRU]
D161  CLEAR  LED-RGB-CCCLEAR  [LED-RGB-THRU]
D162  CLEAR  LED-RGB-CCCLEAR  [LED-RGB-THRU]
D163  CLEAR  LED-RGB-CCCLEAR  [LED-RGB-THRU]
D164  CLEAR  LED-RGB-CCCLEAR  [LED-RGB-THRU]
D165  CLEAR  LED-RGB-CCCLEAR  [LED-RGB-THRU]
D166  CLEAR  LED-RGB-CCCLEAR  [LED-RGB-THRU]
D167  CLEAR  LED-RGB-CCCLEAR  [LED-RGB-THRU]
D168  CLEAR  LED-RGB-CCCLEAR  [LED-RGB-THRU]
D169  CLEAR  LED-RGB-CCCLEAR  [LED-RGB-THRU]
D170  CLEAR  LED-RGB-CCCLEAR  [LED-RGB-THRU]
D171  CLEAR  LED-RGB-CCCLEAR  [LED-RGB-THRU]
D172  CLEAR  LED-RGB-CCCLEAR  [LED-RGB-THRU]
D173  CLEAR  LED-RGB-CCCLEAR  [LED-RGB-THRU]
D174  CLEAR  LED-RGB-CCCLEAR  [LED-RGB-THRU]
D175  CLEAR  LED-RGB-CCCLEAR  [LED-RGB-THRU]
D176  CLEAR  LED-RGB-CCCLEAR  [LED-RGB-THRU]
D177  CLEAR  LED-RGB-CCCLEAR  [LED-RGB-THRU]
D178  CLEAR  LED-RGB-CCCLEAR  [LED-RGB-THRU]
D179  CLEAR  LED-RGB-CCCLEAR  [LED-RGB-THRU]
D180  CLEAR  LED-RGB-CCCLEAR  [LED-RGB-THRU]
D181  CLEAR  LED-RGB-CCCLEAR  [LED-RGB-THRU]
D182  CLEAR  LED-RGB-CCCLEAR  [LED-RGB-THRU]
D183  CLEAR  LED-RGB-CCCLEAR  [LED-RGB-THRU]
D184  CLEAR  LED-RGB-CCCLEAR  [LED-RGB-THRU]
D185  CLEAR  LED-RGB-CCCLEAR  [LED-RGB-THRU]
D186  CLEAR  LED-RGB-CCCLEAR  [LED-RGB-THRU]
D187  CLEAR  LED-RGB-CCCLEAR  [LED-RGB-THRU]
D188  CLEAR  LED-RGB-CCCLEAR  [LED-RGB-THRU]
D189  CLEAR  LED-RGB-CCCLEAR  [LED-RGB-THRU]
D190  CLEAR  LED-RGB-CCCLEAR  [LED-RGB-THRU]
D191  CLEAR  LED-RGB-CCCLEAR  [LED-RGB-THRU]
D192  CLEAR  LED-RGB-CCCLEAR  [LED-RGB-THRU]
D193  CLEAR  LED-RGB-CCCLEAR  [LED-RGB-THRU]
D194  CLEAR  LED-RGB-CCCLEAR  [LED-RGB-THRU]
D195  CLEAR  LED-RGB-CCCLEAR  [LED-RGB-THRU]
D196  CLEAR  LED-RGB-CCCLEAR  [LED-RGB-THRU]
D197  CLEAR  LED-RGB-CCCLEAR  [LED-RGB-THRU]
D198  CLEAR  LED-RGB-CCCLEAR  [LED-RGB-THRU]
D199  CLEAR  LED-RGB-CCCLEAR  [LED-RGB-THRU]
D200  CLEAR  LED-RGB-CCCLEAR  [LED-RGB-THRU]
D201  CLEAR  LED-RGB-CCCLEAR  [LED-RGB-THRU]
D202  CLEAR  LED-RGB-CCCLEAR  [LED-RGB-THRU]
D203  CLEAR  LED-RGB-CCCLEAR  [LED-RGB-THRU]
D204  CLEAR  LED-RGB-CCCLEAR  [LED-RGB-THRU]
D205  CLEAR  LED-RGB-CCCLEAR  [LED-RGB-THRU]
D206  CLEAR  LED-RGB-CCCLEAR  [LED-RGB-THRU]
D207  CLEAR  LED-RGB-CCCLEAR  [LED-RGB-THRU]
D208  CLEAR  LED-RGB-CCCLEAR  [LED-RGB-THRU]
D209  CLEAR  LED-RGB-CCCLEAR  [LED-RGB-THRU]
D210  CLEAR  LED-RGB-CCCLEAR  [LED-RGB-THRU]
D211  CLEAR  LED-RGB-CCCLEAR  [LED-RGB-THRU]
D212  CLEAR  LED-RGB-CCCLEAR  [LED-RGB-THRU]
D213  CLEAR  LED-RGB-CCCLEAR  [LED-RGB-THRU]
D214  CLEAR  LED-RGB-CCCLEAR  [LED-RGB-THRU]
D215  CLEAR  LED-RGB-CCCLEAR  [LED-RGB-THRU]
D216  CLEAR  LED-RGB-CCCLEAR  [LED-RGB-THRU]
D217  CLEAR  LED-RGB-CCCLEAR  [LED-RGB-THRU]
D218  CLEAR  LED-RGB-CCCLEAR  [LED-RGB-THRU]
D219  CLEAR  LED-RGB-CCCLEAR  [LED-RGB-THRU]
D220  CLEAR  LED-RGB-CCCLEAR  [LED-RGB-THRU]
D221  CLEAR  LED-RGB-CCCLEAR  [LED-RGB-THRU]
D222  CLEAR  LED-RGB-CCCLEAR  [LED-RGB-THRU]
D223  CLEAR  LED-RGB-CCCLEAR  [LED-RGB-THRU]
D224  CLEAR  LED-RGB-CCCLEAR  [LED-RGB-THRU]
D225  CLEAR  LED-RGB-CCCLEAR  [LED-RGB-THRU]
D226  CLEAR  LED-RGB-CCCLEAR  [LED-RGB-THRU]
D227  CLEAR  LED-RGB-CCCLEAR  [LED-RGB-THRU]
D228  CLEAR  LED-RGB-CCCLEAR  [LED-RGB-THRU]
D229  CLEAR  LED-RGB-CCCLEAR  [LED-RGB-THRU]
D230  CLEAR  LED-RGB-CCCLEAR  [LED-RGB-THRU]
D231  CLEAR  LED-RGB-CCCLEAR  [LED-RGB-THRU]
D232  CLEAR  LED-RGB-CCCLEAR  [LED-RGB-THRU]
D233  CLEAR  LED-RGB-CCCLEAR  [LED-RGB-THRU]
D234  CLEAR  LED-RGB-CCCLEAR  [LED-RGB-THRU]
D235  CLEAR  LED-RGB-CCCLEAR  [LED-RGB-THRU]
D236  CLEAR  LED-RGB-CCCLEAR  [LED-RGB-THRU]
D237  CLEAR  LED-RGB-CCCLEAR  [LED-RGB-THRU]
D238  CLEAR  LED-RGB-CCCLEAR  [LED-RGB-THRU]
D239  CLEAR  LED-RGB-CCCLEAR  [LED-RGB-THRU]
D240  CLEAR  LED-RGB-CCCLEAR  [LED-RGB-THRU]
D241  CLEAR  LED-RGB-CCCLEAR  [LED-RGB-THRU]
D242  CLEAR  LED-RGB-CCCLEAR  [LED-RGB-THRU]
D243  CLEAR  LED-RGB-CCCLEAR  [LED-RGB-THRU]
D244  CLEAR  LED-RGB-CCCLEAR  [LED-RGB-THRU]
D245  CLEAR  LED-RGB-CCCLEAR  [LED-RGB-THRU]
D246  CLEAR  LED-RGB-CCCLEAR  [LED-RGB-THRU]
D247  CLEAR  LED-RGB-CCCLEAR  [LED-RGB-THRU]
D248  CLEAR  LED-RGB-CCCLEAR  [LED-RGB-THRU]
D249  CLEAR  LED-RGB-CCCLEAR  [LED-RGB-THRU]
D250  CLEAR  LED-RGB-CCCLEAR  [LED-RGB-THRU]
D251  CLEAR  LED-RGB-CCCLEAR  [LED-RGB-THRU]
D252  CLEAR  LED-RGB-CCCLEAR  [LED-RGB-THRU]
D253  CLEAR  LED-RGB-CCCLEAR  [LED-RGB-THRU]
D254  CLEAR  LED-RGB-CCCLEAR  [LED-RGB-THRU]
D255  CLEAR  LED-RGB-CCCLEAR  [LED-RGB-THRU]
D256  CLEAR  LED-RGB-CCCLEAR  [LED-RGB-THRU]
D257  CLEAR  LED-RGB-CCCLEAR  [LED-RGB-THRU]
D258  CLEAR  LED-RGB-CCCLEAR  [LED-RGB-THRU]
D259  CLEAR  LED-RGB-CCCLEAR  [LED-RGB-THRU]
D260  CLEAR  LED-RGB-CCCLEAR  [LED-RGB-THRU]
D261  CLEAR  LED-RGB-CCCLEAR  [LED-RGB-THRU]
D262  CLEAR  LED-RGB-CCCLEAR  [LED-RGB-THRU]
D263  CLEAR  LED-RGB-CCCLEAR  [LED-RGB-THRU]
D264  CLEAR  LED-RGB-CCCLEAR  [LED-RGB-THRU]
D265  CLEAR  LED-RGB-CCCLEAR  [LED-RGB-THRU]
D266  CLEAR  LED-RGB-CCCLEAR  [LED-RGB-THRU]
D267  CLEAR  LED-RGB-CCCLEAR  [LED-RGB-THRU]
D268  CLEAR  LED-RGB-CCCLEAR  [LED-RGB-THRU]
D269  CLEAR  LED-RGB-CCCLEAR  [LED-RGB-THRU]
D270  CLEAR  LED-RGB-CCCLEAR  [LED-RGB-THRU]
D271  CLEAR  LED-RGB-CCCLEAR  [LED-RGB-THRU]
D272  CLEAR  LED-RGB-CCCLEAR  [LED-RGB-THRU]
D273  CLEAR  LED-RGB-CCCLEAR  [LED-RGB-THRU]
D274  CLEAR  LED-RGB-CCCLEAR  [LED-RGB-THRU]
D275  CLEAR  LED-RGB-CCCLEAR  [LED-RGB-THRU]
D276  CLEAR  LED-RGB-CCCLEAR  [LED-RGB-THRU]
D277  CLEAR  LED-RGB-CCCLEAR  [LED-RGB-THRU]
D278  CLEAR  LED-RGB-CCCLEAR  [LED-RGB-THRU]
D279  CLEAR  LED-RGB-CCCLEAR  [LED-RGB-THRU]
D280  CLEAR  LED-RGB-CCCLEAR  [LED-RGB-THRU]
D281  CLEAR  LED-RGB-CCCLEAR  [LED-RGB-THRU]
D282  CLEAR  LED-RGB-CCCLEAR  [LED-RGB-THRU]
D283  CLEAR  LED-RGB-CCCLEAR  [LED-RGB-THRU]
D284  CLEAR  LED-RGB-CCCLEAR  [LED-RGB-THRU]
D285  CLEAR  LED-RGB-CCCLEAR  [LED-RGB-THRU]
D286  CLEAR  LED-RGB-CCCLEAR  [LED-RGB-THRU]
D287  CLEAR  LED-RGB-CCCLEAR  [LED-RGB-THRU]
D288  CLEAR  LED-RGB-CCCLEAR  [LED-RGB-THRU]
D289  CLEAR  LED-RGB-CCCLEAR  [LED-RGB-THRU]
D290  CLEAR  LED-RGB-CCCLEAR  [LED-RGB-THRU]
D291  CLEAR  LED-RGB-CCCLEAR  [LED-RGB-THRU]
D292  CLEAR  LED-RGB-CCCLEAR  [LED-RGB-THRU]
D293  CLEAR  LED-RGB-CCCLEAR  [LED-RGB-THRU]
D294  CLEAR  LED-RGB-CCCLEAR  [LED-RGB-THRU]
D295  CLEAR  LED-RGB-CCCLEAR  [LED-RGB-THRU]
D296  CLEAR  LED-RGB-CCCLEAR  [LED-RGB-THRU]
D297  CLEAR  LED-RGB-CCCLEAR  [LED-RGB-THRU]
D298  CLEAR  LED-RGB-CCCLEAR  [LED-RGB-THRU]
D299  CLEAR  LED-RGB-CCCLEAR  [LED-RGB-THRU]
D300  CLEAR  LED-RGB-CCCLEAR  [LED-RGB-THRU]
D301  CLEAR  LED-RGB-CCCLEAR  [LED-RGB-THRU]
D302  CLEAR  LED-RGB-CCCLEAR  [LED-RGB-THRU]
D303  CLEAR  LED-RGB-CCCLEAR  [LED-RGB-THRU]
D304  CLEAR  LED-RGB-CCCLEAR  [LED-RGB-THRU]
D305  CLEAR  LED-RGB-CCCLEAR  [LED-RGB-THRU]
D306  CLEAR  LED-RGB-CCCLEAR  [LED-RGB-THRU]
D307  CLEAR  LED-RGB-CCCLEAR  [LED-RGB-THRU]
D308  CLEAR  LED-RGB-CCCLEAR  [LED-RGB-THRU]
D309  CLEAR  LED-RGB-CCCLEAR  [LED-RGB-THRU]
D310  CLEAR  LED-RGB-CCCLEAR  [LED-RGB-THRU]
D311  CLEAR  LED-RGB-CCCLEAR  [LED-RGB-THRU]
D312  CLEAR  LED-RGB-CCCLEAR  [LED-RGB-THRU]
D313  CLEAR  LED-RGB-CCCLEAR  [LED-RGB-THRU]
D314  CLEAR  LED-RGB-CCCLEAR  [LED-RGB-THRU]
D315  CLEAR  LED-RGB-CCCLEAR  [LED-RGB-THRU]
D316  CLEAR  LED-RGB-CCCLEAR  [LED-RGB-THRU]
D317  CLEAR  LED-RGB-CCCLEAR  [LED-RGB-THRU]
D318  CLEAR  LED-RGB-CCCLEAR  [LED-RGB-THRU]
D319  CLEAR  LED-RGB-CCCLEAR  [LED-RGB-THRU]
D320  CLEAR  LED-RGB-CCCLEAR  [LED-RGB-THRU]
D321  CLEAR  LED-RGB-CCCLEAR  [LED-RGB-THRU]
D322  CLEAR  LED-RGB-CCCLEAR  [LED-RGB-THRU]
D323  CLEAR  LED-RGB-CCCLEAR  [LED-RGB-THRU]
D324  CLEAR  LED-RGB-CCCLEAR  [LED-RGB-THRU]
D325  CLEAR  LED-RGB-CCCLEAR  [LED-RGB-THRU]
D326  CLEAR  LED-RGB-CCCLEAR  [LED-RGB-THRU]
D327  CLEAR  LED-RGB-CCCLEAR  [LED-RGB-THRU]
D328  CLEAR  LED-RGB-CCCLEAR  [LED-RGB-THRU]
D329  CLEAR  LED-RGB-CCCLEAR  [LED-RGB-THRU]
D330  CLEAR  LED-RGB-CCCLEAR  [LED-RGB-THRU]
D331  CLEAR  LED-RGB-CCCLEAR  [LED-RGB-THRU]
D332  CLEAR  LED-RGB-CCCLEAR  [LED-RGB-THRU]
D333  CLEAR  LED-RGB-CCCLEAR  [LED-RGB-THRU]
D334  CLEAR  LED-RGB-CCCLEAR  [LED-RGB-THRU]
D335  CLEAR  LED-RGB-CCCLEAR  [LED-RGB-THRU]
D336  CLEAR  LED-RGB-CCCLEAR  [LED-RGB-THRU]
D337  CLEAR  LED-RGB-CCCLEAR  [LED-RGB-THRU]
D338  CLEAR  LED-RGB-CCCLEAR  [LED-RGB-THRU]
D339  CLEAR  LED-RGB-CCCLEAR  [LED-RGB-THRU]
D340  CLEAR  LED-RGB-CCCLEAR  [LED-RGB-THRU]
D341  CLEAR  LED-RGB-CCCLEAR  [LED-RGB-THRU]
D342  CLEAR  LED-RGB-CCCLEAR  [LED-RGB-THRU]
D343  CLEAR  LED-RGB-CCCLEAR  [LED-RGB-THRU]
D344  CLEAR  LED-RGB-CCCLEAR  [LED-RGB-THRU]
D345  CLEAR  LED-RGB-CCCLEAR  [LED-RGB-THRU]
D346  CLEAR  LED-RGB-CCCLEAR  [LED-RGB-THRU]
D347  CLEAR  LED-RGB-CCCLEAR  [LED-RGB-THRU]
D348  CLEAR  LED-RGB-CCCLEAR  [LED-RGB-THRU]
D349  CLEAR  LED-RGB-CCCLEAR  [LED-RGB-THRU]
D350  CLEAR  LED-RGB-CCCLEAR  [LED-RGB-THRU]
D351  CLEAR  LED-RGB-CCCLEAR  [LED-RGB-THRU]
D352  CLEAR  LED-RGB-CCCLEAR  [LED-RGB-THRU]
D353  CLEAR  LED-RGB-CCCLEAR  [LED-RGB-THRU]
D354  CLEAR  LED-RGB-CCCLEAR  [LED-RGB-THRU]
D355  CLEAR  LED-RGB-CCCLEAR  [LED-RGB-THRU]
D356  CLEAR  LED-RGB-CCCLEAR  [LED-RGB-THRU]
D357  CLEAR  LED-RGB-CCCLEAR  [LED-RGB-THRU]
D358  CLEAR  LED-RGB-CCCLEAR  [LED-RGB-THRU]
D359  CLEAR  LED-RGB-CCCLEAR  [LED-RGB-THRU]
D360  CLEAR  LED-RGB-CCCLEAR  [LED-RGB-THRU]
D361  CLEAR  LED-RGB-CCCLEAR  [LED-RGB-THRU]
D362  CLEAR  LED-RGB-CCCLEAR  [LED-RGB-THRU]
D363  CLEAR  LED-RGB-CCCLEAR  [LED-RGB-THRU]
D364  CLEAR  LED-RGB-CCCLEAR  [LED-RGB-THRU]
D365  CLEAR  LED-RGB-CCCLEAR  [LED-RGB-THRU]
D366  CLEAR  LED-RGB-CCCLEAR  [LED-RGB-THRU]
D367  CLEAR  LED-RGB-CCCLEAR  [LED-RGB-THRU]
D368  CLEAR  LED-RGB-CCCLEAR  [LED-RGB-THRU]
D369  CLEAR  LED-RGB-CCCLEAR  [LED-RGB-THRU]
D370  CLEAR  LED-RGB-CCCLEAR  [LED-RGB-THRU]
D371  CLEAR  LED-RGB-CCCLEAR  [LED-RGB-THRU]
D372  CLEAR  LED-RGB-CCCLEAR  [LED-RGB-THRU]
D373  CLEAR  LED-RGB-CCCLEAR  [LED-RGB-THRU]
D374  CLEAR  LED-RGB-CCCLEAR  [LED-RGB-THRU]
D375  CLEAR  LED-RGB-CCCLEAR  [LED-RGB-THRU]
D376  CLEAR  LED-RGB-CCCLEAR  [LED-RGB-THRU]
D377  CLEAR  LED-RGB-CCCLEAR  [LED-RGB-THRU]
D378  CLEAR  LED-RGB-CCCLEAR  [LED-RGB-THRU]
D379  CLEAR  LED-RGB-CCCLEAR  [LED-RGB-THRU]
D380  CLEAR  LED-RGB-CCCLEAR  [LED-RGB-THRU]
D381  CLEAR  LED-RGB-CCCLEAR  [LED-RGB-THRU]
D382  CLEAR  LED-RGB-CCCLEAR  [LED-RGB-THRU]
D383  CLEAR  LED-RGB-CCCLEAR  [LED-RGB-THRU]
D384  CLEAR  LED-RGB-CCCLEAR  [LED-RGB-THRU]
D385  CLEAR  LED-RGB-CCCLEAR  [LED-RGB-THRU]
D386  CLEAR  LED-RGB-CCCLEAR  [LED-RGB-THRU]
D387  CLEAR  LED-RGB-CCCLEAR  [LED-RGB-THRU]
D388  CLEAR  LED-RGB-CCCLEAR  [LED-RGB-THRU]
D389  CLEAR  LED-RGB-CCCLEAR  [LED-RGB-THRU]
D390  CLEAR  LED-RGB-CCCLEAR  [LED-RGB-THRU]
D391  CLEAR  LED-RGB-CCCLEAR  [LED-RGB-THRU]
D392  CLEAR  LED-RGB-CCCLEAR  [LED-RGB-THRU]
D393  CLEAR  LED-RGB-CCCLEAR  [LED-RGB-THRU]
D394  CLEAR  LED-RGB-CCCLEAR  [LED-RGB-THRU]
D395  CLEAR  LED-RGB-CCCLEAR  [LED-RGB-THRU]
D396  CLEAR  LED-RGB-CCCLEAR  [LED-RGB-THRU]
D397  CLEAR  LED-RGB-CCCLEAR  [LED-RGB-THRU]
D398  CLEAR  LED-RGB-CCCLEAR  [LED-RGB-THRU]
D399  CLEAR  LED-RGB-CCCLEAR  [LED-RGB-THRU]
D400  CLEAR  LED-RGB-CCCLEAR  [LED-RGB-THRU]
D401  CLEAR  LED-RGB-CCCLEAR  [LED-RGB-THRU]
D402  CLEAR  LED-RGB-CCCLEAR  [LED-RGB-THRU]
D403  CLEAR  LED-RGB-CCCLEAR  [LED-RGB-THRU]
D404  CLEAR  LED-RGB-CCCLEAR  [LED-RGB-THRU]
D405  CLEAR  LED-RGB-CCCLEAR  [LED-RGB-THRU]
D406  CLEAR  LED-RGB-CCCLEAR  [LED-RGB-THRU]
D407  CLEAR  LED-RGB-CCCLEAR  [LED-RGB-THRU]
D408  CLEAR  LED-RGB-CCCLEAR  [LED-RGB-THRU]
D409  CLEAR  LED-RGB-CCCLEAR  [LED-RGB-THRU]
D410  CLEAR  LED-RGB-CCCLEAR  [LED-RGB-THRU]
D411  CLEAR  LED-RGB-CCCLEAR  [LED-RGB-THRU]
D412  CLEAR  LED-RGB-CCCLEAR  [LED-RGB-THRU]
D413  CLEAR  LED-RGB-CCCLEAR  [LED-RGB-THRU]
D414  CLEAR  LED-RGB-CCCLEAR  [LED-RGB-THRU]
D415  CLEAR  LED-RGB-CCCLEAR  [LED-RGB-THRU]
D416  CLEAR  LED-RGB-CCCLEAR  [LED-RGB-THRU]
D417  CLEAR  LED-RGB-CCCLEAR  [LED-RGB-THRU]
D418  CLEAR  LED-RGB-CCCLEAR  [LED-RGB-THRU]
D419  CLEAR  LED-RGB-CCCLEAR  [LED-RGB-THRU]
D420  CLEAR  LED-RGB-CCCLEAR  [LED-RGB-THRU]
D421  CLEAR  LED-RGB-CCCLEAR  [LED-RGB-THRU]
D422  CLEAR  LED-RGB-CCCLEAR  [LED-RGB-THRU]
D423  CLEAR  LED-RGB-CCCLEAR  [LED-RGB-THRU]
D424  CLEAR  LED-RGB-CCCLEAR  [LED-RGB-THRU]
D425  CLEAR  LED-RGB-CCCLEAR  [LED-RGB-THRU]
D426  CLEAR  LED-RGB-CCCLEAR  [LED-RGB-THRU]
D427  CLEAR  LED-RGB-CCCLEAR  [LED-RGB-THRU]
D428  CLEAR  LED-RGB-CCCLEAR  [LED-RGB-THRU]
D429  CLEAR  LED-RGB-CCCLEAR  [LED-RGB-THRU]
D430  CLEAR  LED-RGB-CCCLEAR  [LED-RGB-THRU]
D431  CLEAR  LED-RGB-CCCLEAR  [LED-RGB-THRU]
D432  CLEAR  LED-RGB-CCCLEAR  [LED-RGB-THRU]
D433  CLEAR  LED-RGB-CCCLEAR  [LED-RGB-THRU]
D434  CLEAR  LED-RGB-CCCLEAR  [LED-RGB-THRU]
D435  CLEAR  LED-RGB-CCCLEAR  [LED-RGB-THRU]
D436  CLEAR  LED-RGB-CCCLEAR  [LED-RGB-THRU]
D437  CLEAR  LED-RGB-CCCLEAR  [LED-RGB-THRU]
D438  CLEAR  LED-RGB-CCCLEAR  [LED-RGB-THRU]
D439  CLEAR  LED-RGB-CCCLEAR  [LED-RGB-THRU]
D440  CLEAR  LED-RGB-CCCLEAR  [LED-RGB-THRU]
D441  CLEAR  LED-RGB-CCCLEAR  [LED-RGB-THRU]
D442  CLEAR  LED-RGB-CCCLEAR  [LED-RGB-THRU]
D443  CLEAR  LED-RGB-CCCLEAR  [LED-RGB-THRU]
D444  CLEAR  LED-RGB-CCCLEAR  [LED-RGB-THRU]
D445  CLEAR  LED-RGB-CCCLEAR  [LED-RGB-THRU]
D446  CLEAR  LED-RGB-CCCLEAR  [LED-RGB-THRU]
D447  CLEAR  LED-RGB-CCCLEAR  [LED-RGB-THRU]
D448  CLEAR  LED-RGB-CCCLEAR  [LED-RGB-THRU]
D449  CLEAR  LED-RGB-CCCLEAR  [LED-RGB-THRU]
D450  CLEAR  LED-RGB-CCCLEAR  [LED-RGB-THRU]
D451  CLEAR  LED-RGB-CCCLEAR  [LED-RGB-THRU]
D452  CLEAR  LED-RGB-CCCLEAR  [LED-RGB-THRU]
D453  CLEAR  LED-RGB-CCCLEAR  [LED-RGB-THRU]
D454  CLEAR  LED-RGB-CCCLEAR  [LED-RGB-THRU]
D455  CLEAR  LED-RGB-CCCLEAR  [LED-RGB-THRU]
D456  CLEAR  LED-RGB-CCCLEAR  [LED-RGB-THRU]
D457  CLEAR  LED-RGB-CCCLEAR  [LED-RGB-THRU]
D458  CLEAR  LED-RGB-CCCLEAR  [LED-RGB-THRU]
D459  CLEAR  LED-RGB-CCCLEAR  [LED-RGB-THRU]
D460  CLEAR  LED-RGB-CCCLEAR  [LED-RGB-THRU]
D461  CLEAR  LED-RGB-CCCLEAR  [LED-RGB-THRU]
D462  CLEAR  LED-RGB-CCCLEAR  [LED-RGB-THRU]
D463  CLEAR  LED-RGB-CCCLEAR  [LED-RGB-THRU]
D464  CLEAR  LED-RGB-CCCLEAR  [LED-RGB-THRU]
D465  CLEAR  LED-RGB-CCCLEAR  [LED-RGB-THRU]
D466  CLEAR  LED-RGB-CCCLEAR  [LED-RGB-THRU]
D467  CLEAR  LED-RGB-CCCLEAR  [LED-RGB-THRU]
D468  CLEAR  LED-RGB-CCCLEAR  [LED-RGB-THRU]
D469  CLEAR  LED-RGB-CCCLEAR  [LED-RGB-THRU]
D470  CLEAR  LED-RGB-CCCLEAR  [LED-RGB-THRU]
D471  CLEAR  LED-RGB-CCCLEAR  [LED-RGB-THRU]
D472  CLEAR  LED-RGB-CCCLEAR  [LED-RGB-THRU]
D473  CLEAR  LED-RGB-CCCLEAR  [LED-RGB-THRU]
D474  CLEAR  LED-RGB-CCCLEAR  [LED-RGB-THRU]
D475  CLEAR  LED-RGB-CCCLEAR  [LED-RGB-THRU]
D476  CLEAR  LED-RGB-CCCLEAR  [LED-RGB-THRU]
D477  CLEAR  LED-RGB-CCCLEAR  [LED-RGB-THRU]
D478  CLEAR  LED-RGB-CCCLEAR  [LED-RGB-THRU]
D479  CLEAR  LED-RGB-CCCLEAR  [LED-RGB-THRU]
D480  CLEAR  LED-RGB-CCCLEAR  [LED-RGB-THRU]
D481  CLEAR  LED-RGB-CCCLEAR  [LED-RGB-THRU]
D482  CLEAR  LED-RGB-CCCLEAR  [LED-RGB-THRU]
D483  CLEAR  LED-RGB-CCCLEAR  [LED-RGB-THRU]
D484  CLEAR  LED-RGB-CCCLEAR  [LED-RGB-THRU]
D485  CLEAR  LED-RGB-CCCLEAR  [LED-RGB-THRU]
D486  CLEAR  LED-RGB-CCCLEAR  [LED-RGB-THRU]
D487  CLEAR  LED-RGB-CCCLEAR  [LED-RGB-THRU]
D488  CLEAR  LED-RGB-CCCLEAR  [LED-RGB-THRU]
D489  CLEAR  LED-RGB-CCCLEAR  [LED-RGB-THRU]
D490  CLEAR  LED-RGB-CCCLEAR  [LED-RGB-THRU]
D491  CLEAR  LED-RGB-CCCLEAR  [LED-RGB-THRU]
D492  CLEAR  LED-RGB-CCCLEAR  [LED-RGB-THRU]
D493  CLEAR  LED-RGB-CCCLEAR  [LED-RGB-THRU]
D494  CLEAR  LED-RGB-CCCLEAR  [LED-RGB-THRU]
D495  CLEAR  LED-RGB-CCCLEAR  [LED-RGB-THRU]
D496  CLEAR  LED-RGB-CCCLEAR  [LED-RGB-THRU]
D497  CLEAR  LED-RGB-CCCLEAR  [LED-RGB-THRU]
D498  CLEAR  LED-RGB-CCCLEAR  [LED-RGB-THRU]
D499  CLEAR  LED-RGB-CCCLEAR  [LED-RGB-THRU]
D500  CLEAR  LED-RGB-CCCLEAR  [LED-RGB-THRU]
D501  CLEAR  LED-RGB-CCCLEAR  [LED-RGB-THRU]
D502  CLEAR  LED-RGB-CCCLEAR  [LED-RGB-THRU]
D503  CLEAR  LED-RGB-CCCLEAR  [LED-RGB-THRU]
D504  CLEAR  LED-RGB-CCCLEAR  [LED-RGB-THRU]
D505  CLEAR  LED-RGB-CCCLEAR  [LED-RGB-THRU]
D506  CLEAR  LED-RGB-CCCLEAR  [LED-RGB-THRU]
D507  CLEAR  LED-RGB-CCCLEAR  [LED-RGB-THRU]
D508  CLEAR  LED-RGB-CCCLEAR  [LED-RGB-THRU]
D509  CLEAR  LED-RGB-CCCLEAR  [LED-RGB-THRU]
D510  CLEAR  LED-RGB-CCCLEAR  [LED-RGB-THRU]
D511  CLEAR  LED-RGB-CCCLEAR  [LED-RGB-THRU]
D512  CLEAR  LED-RGB-CCCLEAR  [LED-RGB-THRU]
IC1  TPIC6B595N  TPIC6B596N  [DIL20]
IC2  TPIC6B595N  TPIC6B596N  [DIL20]
IC3  TPIC6B595N  TPIC6B596N  [DIL20]
IC4  TPIC6B595N  TPIC6B596N  [DIL20]
IC5  TPIC6B595N  TPIC6B596N  [DIL20]
IC6  TPIC6B595N  TPIC6B596N  [DIL20]
IC7  TPIC6B595N  TPIC6B596N  [DIL20]
IC8  TPIC6B595N  TPIC6B596N  [DIL20]
Q1  S8550D  BC558B  [TO92-EBC]
Q2  S8550D  BC558B  [TO92-EBC]
Q3  S8550D  BC558B  [TO92-EBC]
Q4  S8550D  BC558B  [TO92-EBC]
Q5  S8550D  BC558B  [TO92-EBC]
Q6  S8550D  BC558B  [TO92-EBC]
Q7  S8550D  BC558B  [TO92-EBC]
Q8  S8550D  BC558B  [TO92-EBC]
Q9  S8550D  BC558B  [TO92-EBC]
Q10  S8550D  BC558B  [TO92-EBC]
Q11  S8550D  BC558B  [TO92-EBC]
Q12  S8550D  BC558B  [TO92-EBC]
Q13  S8550D  BC558B  [TO92-EBC]
Q14  S8550D  BC558B  [TO92-EBC]
Q15  S8550D  BC558B  [TO92-EBC]
Q16  S8550D  BC558B  [TO92-EBC]
Q17  S8550D  BC558B  [TO92-EBC]
Q18  S8550D  BC558B  [TO92-EBC]
Q19  S8550D  BC558B  [TO92-EBC]
Q20  S8550D  BC558B  [TO92-EBC]
Q21  S8550D  BC558B  [TO92-EBC]
Q22  S8550D  BC558B  [TO92-EBC]
Q23  S8550D  BC558B  [TO92-EBC]
Q24  S8550D  BC558B  [TO92-EBC]
R1  150R  R-EU_0207/10  [0207/10]
R2  150R  R-EU_0207/10  [0207/10]
R3  150R  R-EU_0207/10  [0207/10]
R4  150R  R-EU_0207/10  [0207/10]
R5  150R  R-EU_0207/10  [0207/10]
R6  150R  R-EU_0207/10  [0207/10]
R7  150R  R-EU_0207/10  [0207/10]
R8  150R  R-EU_0207/10  [0207/10]
R9  150R  R-EU_0207/10  [0207/10]
R10  150R  R-EU_0207/10  [0207/10]
R11  150R  R-EU_0207/10  [0207/10]
R12  150R  R-EU_0207/10  [0207/10]
R13  150R  R-EU_0207/10  [0207/10]
R14  150R  R-EU_0207/10  [0207/10]
R15  150R  R-EU_0207/10  [0207/10]
R16  150R  R-EU_0207/10  [0207/10]
R17  150R  R-EU_0207/10  [0207/10]
R18  150R  R-EU_0207/10  [0207/10]
R19  150R  R-EU_0207/10  [0207/10]
R20  150R  R-EU_0207/10  [0207/10]
R21  150R  R-EU_0207/10  [0207/10]
R22  150R  R-EU_0207/10  [0207/10]
R23  150R  R-EU_0207/10  [0207/10]
R24  150R  R-EU_0207/10  [0207/10]
R25  150R  R-EU_0207/10  [0207/10]
R26  150R  R-EU_0207/10  [0207/10]
R27  150R  R-EU_0207/10  [0207/10]
R28  150R  R-EU_0207/10  [0207/10]
R29  150R  R-EU_0207/10  [0207/10]
R30  150R  R-EU_0207/10  [0207/10]
R31  150R  R-EU_0207/10  [0207/10]
R32  150R  R-EU_0207/10  [0207/10]
R33  150R  R-EU_0207/10  [0207/10]
R34  150R  R-EU_0207/10  [0207/10]
R35  150R  R-EU_0207/10  [0207/10]
R36  150R  R-EU_0207/10  [0207/10]
R37  150R  R-EU_0207/10  [0207/10]
R38  150R  R-EU_0207/10  [0207/10]
R39  150R  R-EU_0207/10  [0207/10]
R40  150R  R-EU_0207/10  [0207/10]
R41  150R  R-EU_0207/10  [0207/10]
R42  150R  R-EU_0207/10  [0207/10]
R43  150R  R-EU_0207/10  [0207/10]
R44  150R  R-EU_0207/10  [0207/10]
R45  150R  R-EU_0207/10  [0207/10]
R46  150R  R-EU_0207/10  [0207/10]
R47  150R  R-EU_0207/10  [0207/10]
R48  150R  R-EU_0207/10  [0207/10]
R49  150R  R-EU_0207/10  [0207/10]
R50  150R  R-EU_0207/10  [0207/10]
R51  150R  R-EU_0207/10  [0207/10]
R52  150R  R-EU_0207/10  [0207/10]
R53  150R  R-EU_0207/10  [0207/10]
R54  150R  R-EU_0207/10  [0207/10]
R55  150R  R-EU_0207/10  [0207/10]
R56  150R  R-EU_0207/10  [0207/10]
R57  150R  R-EU_0207/10  [0207/10]
R58  150R  R-EU_0207/10  [0207/10]
R59  150R  R-EU_0207/10  [0207/10]
R60  150R  R-EU_0207/10  [0207/10]
R61  150R  R-EU_0207/10  [0207/10]
R62  150R  R-EU_0207/10  [0207/10]
R63  150R  R-EU_0207/10  [0207/10]
R64  150R  R-EU_0207/10  [0207/10]